# EAGLE design mt15_reg (EAGLE 6.6.0)

## Sheet 1 of 6
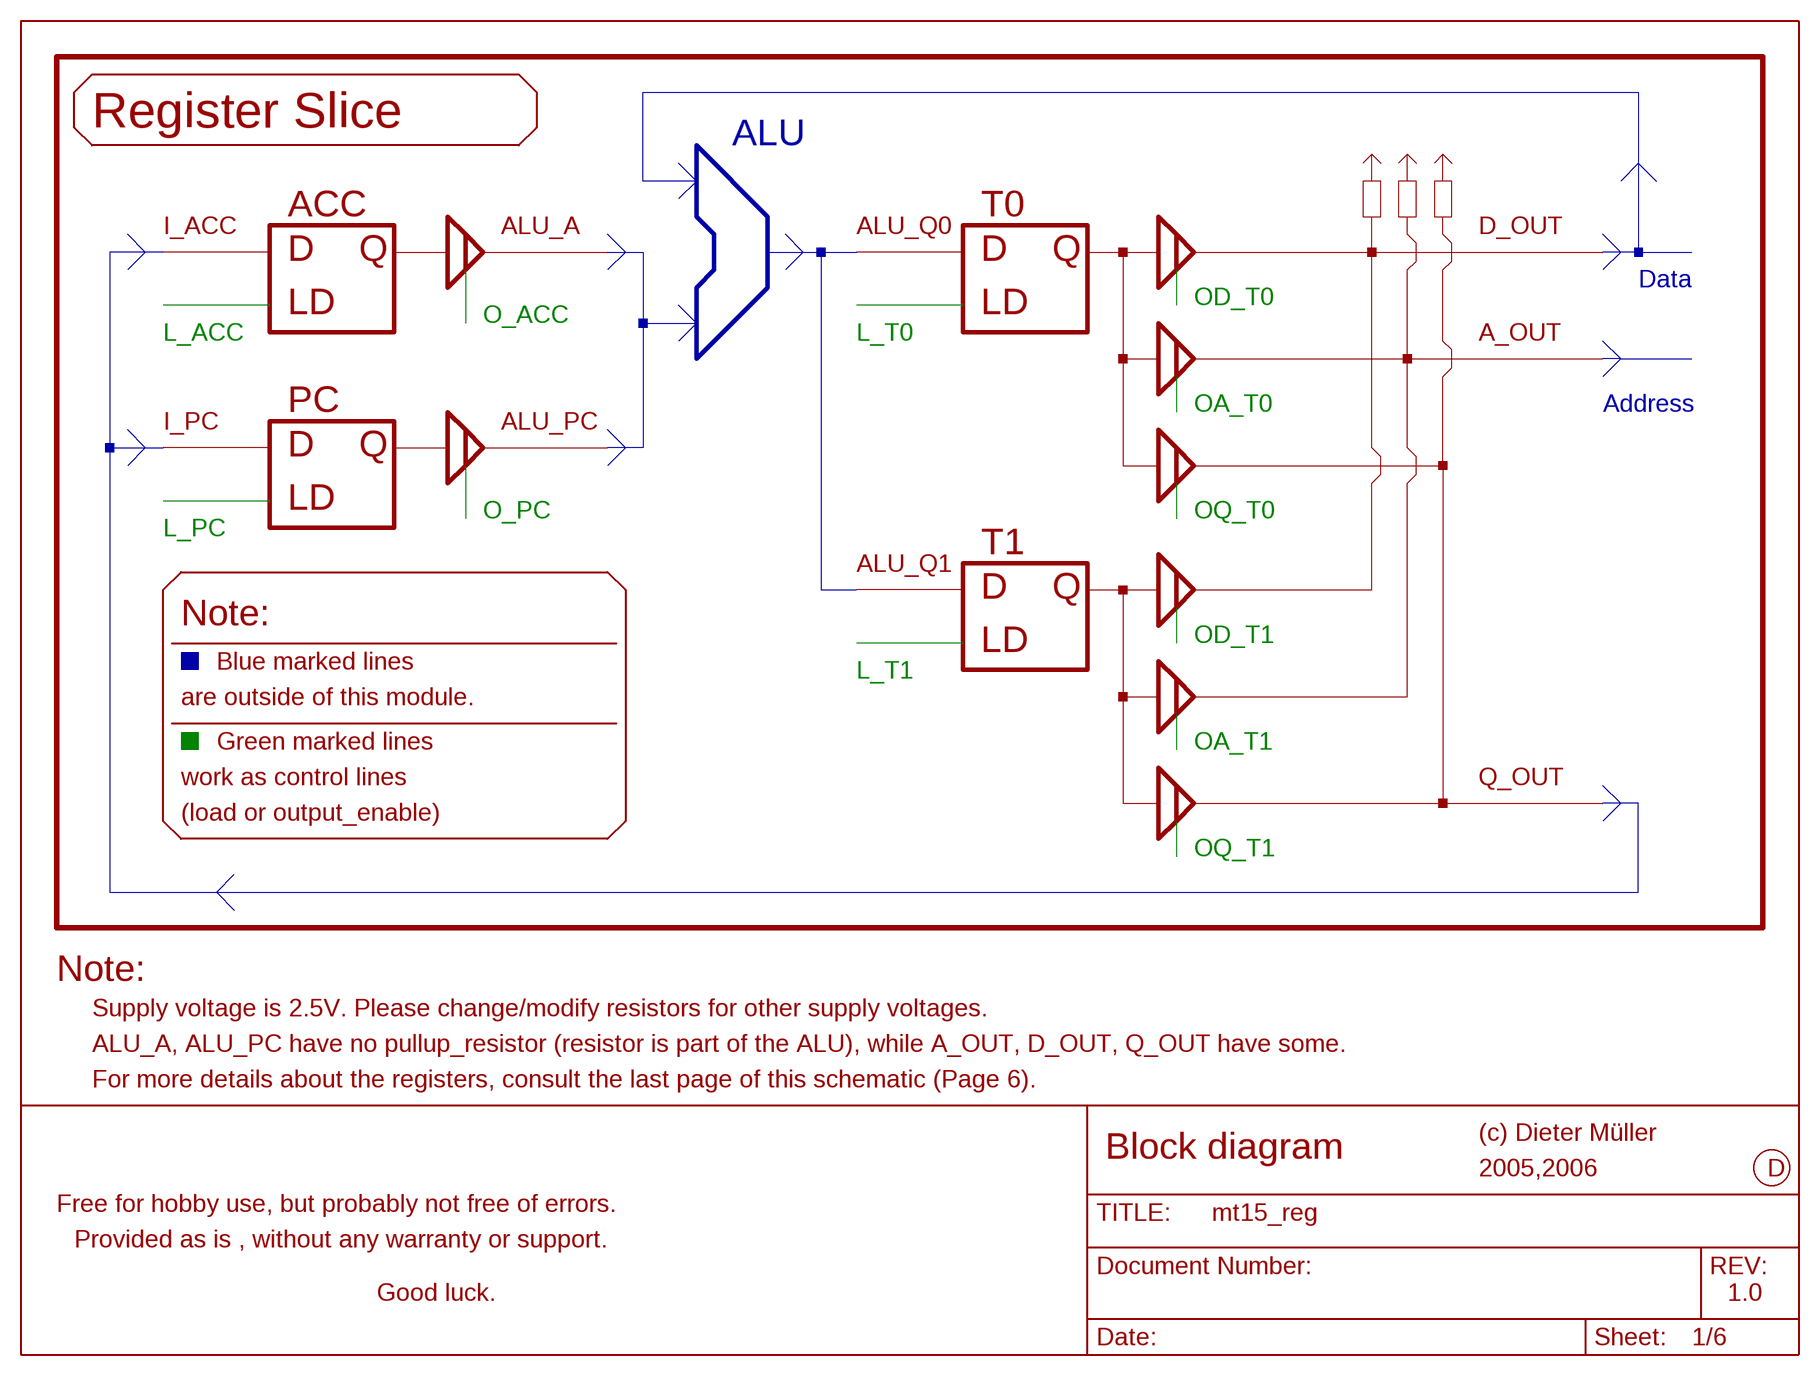
[diagram p0: schematic, sheet 1]

### Buses
B$14
B$15
B$18
B$19

### Notes on the sheet
- Register Slice
- ALU
- ACC | T0
- I_ACC | ALU_A | ALU_Q0 | D_OUT
- D | Q | D | Q
- Data
- OD_T0
- LD | LD
- O_ACC
- L_ACC | L_T0 | A_OUT
- PC | OA_T0 | Address
- I_PC | ALU_PC
- D | Q
- LD
- O_PC | OQ_T0
- L_PC
- T1
- ALU_Q1
- D | Q
- Note:
- OD_T1
- LD
- Blue marked lines
- L_T1
- are outside of this module.
- Green marked lines | OA_T1
- work as control lines | Q_OUT
- (load or output_enable)
- OQ_T1
- Note:
- Supply voltage is 2.5V. Please change/modify resistors for other supply voltages.
- ALU_A, ALU_PC have no pullup_resistor (resistor is part of the ALU), while A_OUT, D_OUT, Q_OUT have some.
- For more details about the registers, consult the last page of this schematic (Page 6).
- (c) Dieter Müller
- Block diagram
- 2005,2006 | D
- Free for hobby use, but probably not free of errors.
- Provided as is , without any warranty or support.
- Good luck. | 1.0
- Das Marketing hat etwas verkauft für Geld, für Geld
- Es wurde noch nicht erfunden auf der Welt, der Welt.
- Und sie geben dir nur ein paar Stunden Zeit,
- und stellen dir wieder kein Geld bereit.
- Aber unbeirrbar, arbeitest du vor dich hin.
- Du zeichnest nun dein Schaltbild am PC, PC.
- Er stürzt dauernd ab, dein Rücken tut dir weh, so weh.
- Ein paar Vorgaben kannst du nicht lesen hier,
- dahingekritzelt auf Brotpapier.
- Aber unbeirrbar, arbeitest du vor dich hin.
- Die Chips haben heut' Gehäuse winzig klein, so klein.
- Wer hat dich gefragt, du lötest sie nur ein, nur ein.
- Und das Zinn verläuft zu 'nem kleinen See,
- so langsam tun' dir die Augen weh.
- Aber unbeirrbar, arbeitest du vor dich hin.
- Für das Projekt noch Software bräuchte man, braucht man.
- Ein paar tausend Zeilen Quellcode muss noch dran, noch dran.
- Ein paar Bugs, die hast du schon festgestellt.
- Der Compiler dir in den Rücken fällt.
- Aber unbeirrbar, arbeitest du vor dich hin.
- Das Gerät ist fertig, doch an Fehlern reich, so reich.
- Du würdest sie gerne finden, und zwar gleich, jetzt gleich.
- Doch das Marketing verkauft es dann,
- und schleppt dir den nächsten Auftrag ran.
- Aber unbeirrbar, arbeitest du vor dich hin.

## Sheet 2 of 6
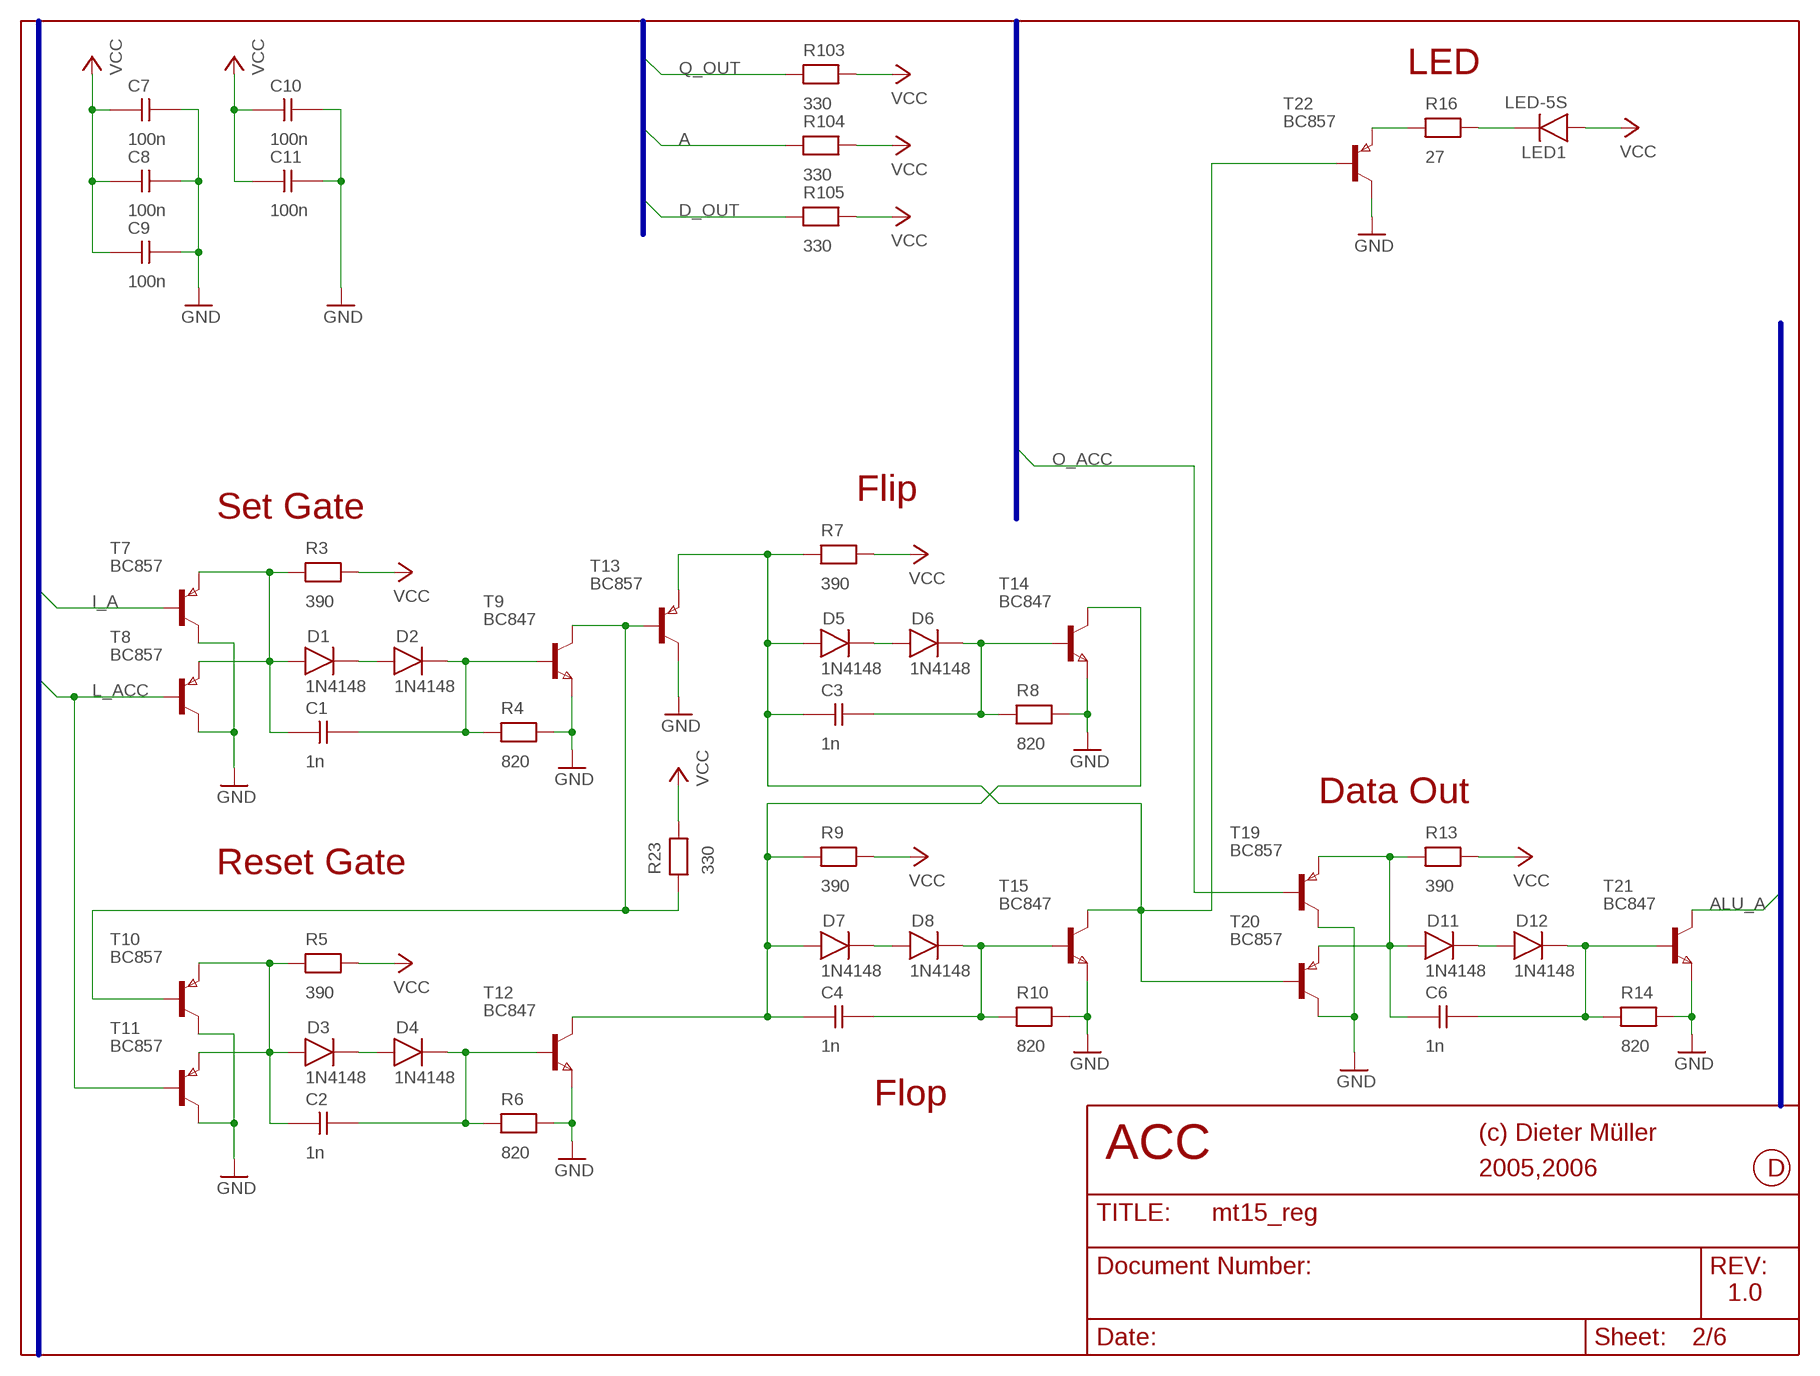
[diagram p1: schematic, sheet 2]

### Parts
C1  1n  CAPNP-5  [0204]
C2  1n  CAPNP-5  [0204]
C3  1n  CAPNP-5  [0204]
C4  1n  CAPNP-5  [0204]
C6  1n  CAPNP-5  [0204]
C7  100n  CAPNP-5  [0204]
C8  100n  CAPNP-5  [0204]
C9  100n  CAPNP-5  [0204]
C10  100n  CAPNP-5  [0204]
C11  100n  CAPNP-5  [0204]
D1  1N4148  DIODE-7,5  [0204D]
D2  1N4148  DIODE-7,5  [0204D]
D3  1N4148  DIODE-7,5  [0204D]
D4  1N4148  DIODE-7,5  [0204D]
D5  1N4148  DIODE-7,5  [0204D]
D6  1N4148  DIODE-7,5  [0204D]
D7  1N4148  DIODE-7,5  [0204D]
D8  1N4148  DIODE-7,5  [0204D]
D11  1N4148  DIODE-7,5  [0204D]
D12  1N4148  DIODE-7,5  [0204D]
LED1  LED-5S  [LED-5S]
R3  390  RESEU-7,5  [0204]
R4  820  RESEU-7,5  [0204]
R5  390  RESEU-7,5  [0204]
R6  820  RESEU-7,5  [0204]
R7  390  RESEU-7,5  [0204]
R8  820  RESEU-7,5  [0204]
R9  390  RESEU-7,5  [0204]
R10  820  RESEU-7,5  [0204]
R13  390  RESEU-7,5  [0204]
R14  820  RESEU-7,5  [0204]
R16  27  RESEU-7,5  [0204]
R23  330  RESEU-7,5  [0204]
R103  330  RESEU-7,5  [0204]
R104  330  RESEU-7,5  [0204]
R105  330  RESEU-7,5  [0204]
T7  BC857  BC557  [SOT-23]
T8  BC857  BC557  [SOT-23]
T9  BC847  BC547  [SOT-23]
T10  BC857  BC557  [SOT-23]
T11  BC857  BC557  [SOT-23]
T12  BC847  BC547  [SOT-23]
T13  BC857  BC557  [SOT-23]
T14  BC847  BC547  [SOT-23]
T15  BC847  BC547  [SOT-23]
T19  BC857  BC557  [SOT-23]
T20  BC857  BC557  [SOT-23]
T21  BC847  BC547  [SOT-23]
T22  BC857  BC557  [SOT-23]

### Nets
A: R104.1 ; also sheet 4,5
ALU_A: T21.3(C)
D_OUT: R105.1 ; also sheet 4,5
GND: C7.2 C8.2 C9.2 C10.2 C11.2 R4.2 R6.2 R8.2 R10.2 R14.2 T7.3(C) T8.3(C) T9.1(E) T10.3(C) T11.3(C) T12.1(E) T13.3(C) T14.1(E) T15.1(E) T19.3(C) T20.3(C) T21.1(E) T22.3(C) ; also sheet 3,4,5
I_A: T7.2(B)
L_ACC: T8.2(B) T11.2(B)
N$11: C1.1 D1.1(A) R3.1 T7.1(E) T8.1(E)
N$12: D1.2(K) D2.1(A)
N$14: C1.2 D2.2(K) R4.1 T9.2(B)
N$15: D5.2(K) D6.1(A)
N$17: C2.1 D3.1(A) R5.1 T10.1(E) T11.1(E)
N$18: D3.2(K) D4.1(A)
N$19: C2.2 D4.2(K) R6.1 T12.2(B)
N$20: C3.2 D6.2(K) R8.1 T14.2(B)
N$21: D7.2(K) D8.1(A)
N$22: C4.2 D8.2(K) R10.1 T15.2(B)
N$23: C4.1 D7.1(A) R9.1 T12.3(C) T14.3(C)
N$24: C3.1 D5.1(A) R7.1 T13.1(E) T15.3(C) T20.2(B) T22.2(B)
N$25: R16.1 T22.1(E)
N$29: LED1.2(K) R16.2
N$30: C6.1 D11.1(A) R13.1 T19.1(E) T20.1(E)
N$31: D11.2(K) D12.1(A)
N$32: C6.2 D12.2(K) R14.1 T21.2(B)
N$45: R23.1 T9.3(C) T10.2(B) T13.2(B)
O_ACC: T19.2(B)
Q_OUT: R103.1 ; also sheet 4,5
VCC: C7.1 C8.1 C9.1 C10.1 C11.1 LED1.1(A) R3.2 R5.2 R7.2 R9.2 R13.2 R23.2 R103.2 R104.2 R105.2 ; also sheet 3,4,5,6

### Buses
B$1
B$2
B$3
B$13

### Notes on the sheet
- LED
- Flip
- Set Gate
- Data Out
- Reset Gate
- Flop
- (c) Dieter Müller
- ACC
- 2005,2006 | D
- 1.0

## Sheet 3 of 6
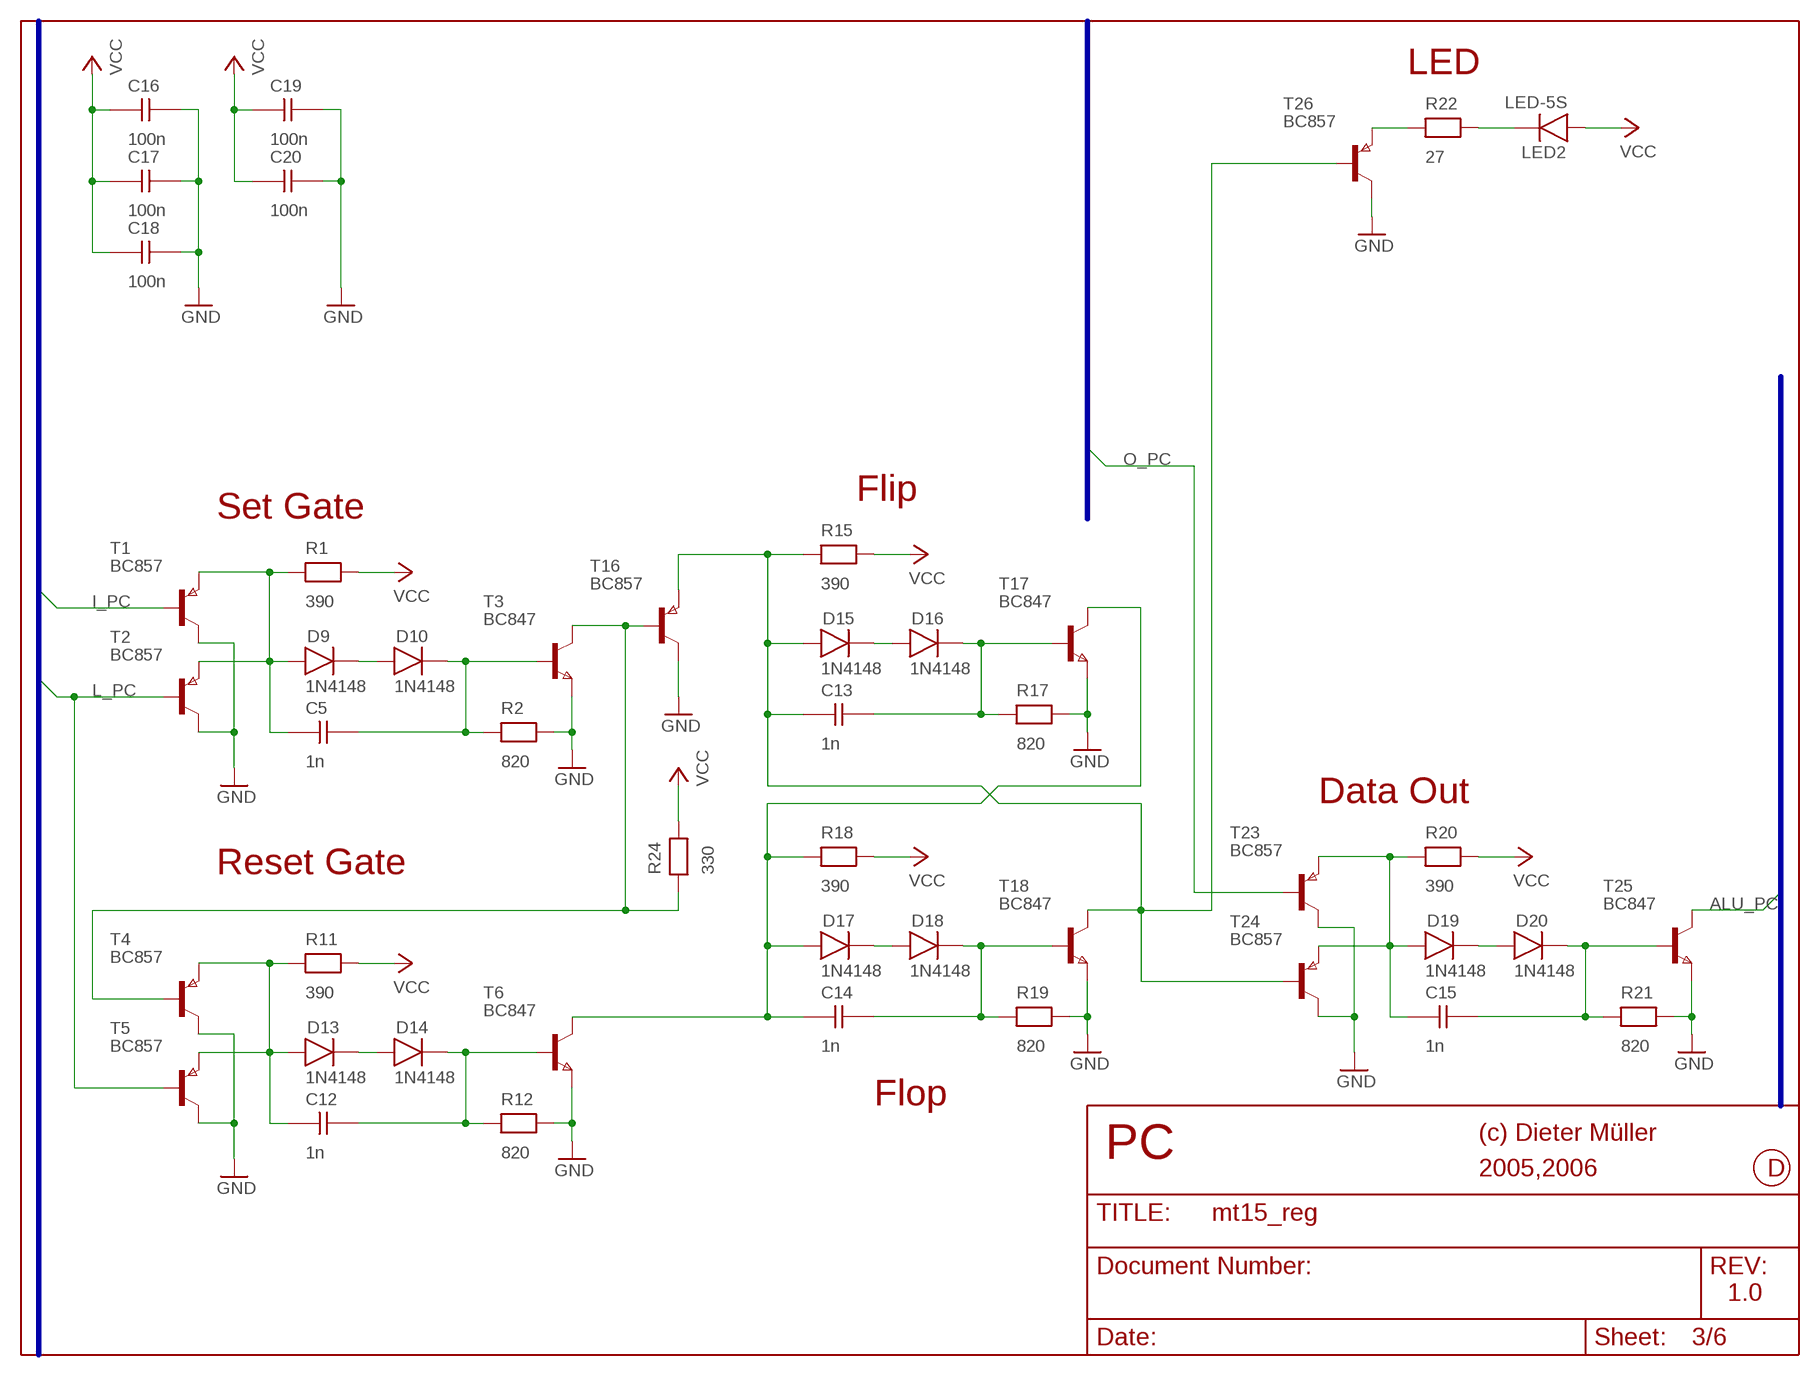
[diagram p2: schematic, sheet 3]

### Parts
C5  1n  CAPNP-5  [0204]
C12  1n  CAPNP-5  [0204]
C13  1n  CAPNP-5  [0204]
C14  1n  CAPNP-5  [0204]
C15  1n  CAPNP-5  [0204]
C16  100n  CAPNP-5  [0204]
C17  100n  CAPNP-5  [0204]
C18  100n  CAPNP-5  [0204]
C19  100n  CAPNP-5  [0204]
C20  100n  CAPNP-5  [0204]
D9  1N4148  DIODE-7,5  [0204D]
D10  1N4148  DIODE-7,5  [0204D]
D13  1N4148  DIODE-7,5  [0204D]
D14  1N4148  DIODE-7,5  [0204D]
D15  1N4148  DIODE-7,5  [0204D]
D16  1N4148  DIODE-7,5  [0204D]
D17  1N4148  DIODE-7,5  [0204D]
D18  1N4148  DIODE-7,5  [0204D]
D19  1N4148  DIODE-7,5  [0204D]
D20  1N4148  DIODE-7,5  [0204D]
LED2  LED-5S  [LED-5S]
R1  390  RESEU-7,5  [0204]
R2  820  RESEU-7,5  [0204]
R11  390  RESEU-7,5  [0204]
R12  820  RESEU-7,5  [0204]
R15  390  RESEU-7,5  [0204]
R17  820  RESEU-7,5  [0204]
R18  390  RESEU-7,5  [0204]
R19  820  RESEU-7,5  [0204]
R20  390  RESEU-7,5  [0204]
R21  820  RESEU-7,5  [0204]
R22  27  RESEU-7,5  [0204]
R24  330  RESEU-7,5  [0204]
T1  BC857  BC557  [SOT-23]
T2  BC857  BC557  [SOT-23]
T3  BC847  BC547  [SOT-23]
T4  BC857  BC557  [SOT-23]
T5  BC857  BC557  [SOT-23]
T6  BC847  BC547  [SOT-23]
T16  BC857  BC557  [SOT-23]
T17  BC847  BC547  [SOT-23]
T18  BC847  BC547  [SOT-23]
T23  BC857  BC557  [SOT-23]
T24  BC857  BC557  [SOT-23]
T25  BC847  BC547  [SOT-23]
T26  BC857  BC557  [SOT-23]

### Nets
ALU_PC: T25.3(C)
GND: C16.2 C17.2 C18.2 C19.2 C20.2 R2.2 R12.2 R17.2 R19.2 R21.2 T1.3(C) T2.3(C) T3.1(E) T4.3(C) T5.3(C) T6.1(E) T16.3(C) T17.1(E) T18.1(E) T23.3(C) T24.3(C) T25.1(E) T26.3(C) ; also sheet 2,4,5
I_PC: T1.2(B)
L_PC: T2.2(B) T5.2(B)
N$9: C5.1 D9.1(A) R1.1 T1.1(E) T2.1(E)
N$10: D9.2(K) D10.1(A)
N$13: C5.2 D10.2(K) R2.1 T3.2(B)
N$26: R24.1 T3.3(C) T4.2(B) T16.2(B)
N$27: C12.1 D13.1(A) R11.1 T4.1(E) T5.1(E)
N$28: D13.2(K) D14.1(A)
N$33: C12.2 D14.2(K) R12.1 T6.2(B)
N$34: D15.2(K) D16.1(A)
N$35: C13.2 D16.2(K) R17.1 T17.2(B)
N$36: D17.2(K) D18.1(A)
N$37: C14.2 D18.2(K) R19.1 T18.2(B)
N$38: C14.1 D17.1(A) R18.1 T6.3(C) T17.3(C)
N$39: C13.1 D15.1(A) R15.1 T16.1(E) T18.3(C) T24.2(B) T26.2(B)
N$40: C15.1 D19.1(A) R20.1 T23.1(E) T24.1(E)
N$41: D19.2(K) D20.1(A)
N$42: C15.2 D20.2(K) R21.1 T25.2(B)
N$43: R22.1 T26.1(E)
N$44: LED2.2(K) R22.2
O_PC: T23.2(B)
VCC: C16.1 C17.1 C18.1 C19.1 C20.1 LED2.1(A) R1.2 R11.2 R15.2 R18.2 R20.2 R24.2 ; also sheet 2,4,5,6

### Buses
B$1
B$2
B$3

### Notes on the sheet
- LED
- Flip
- Set Gate
- Data Out
- Reset Gate
- Flop
- (c) Dieter Müller
- PC
- 2005,2006 | D
- 1.0

## Sheet 4 of 6
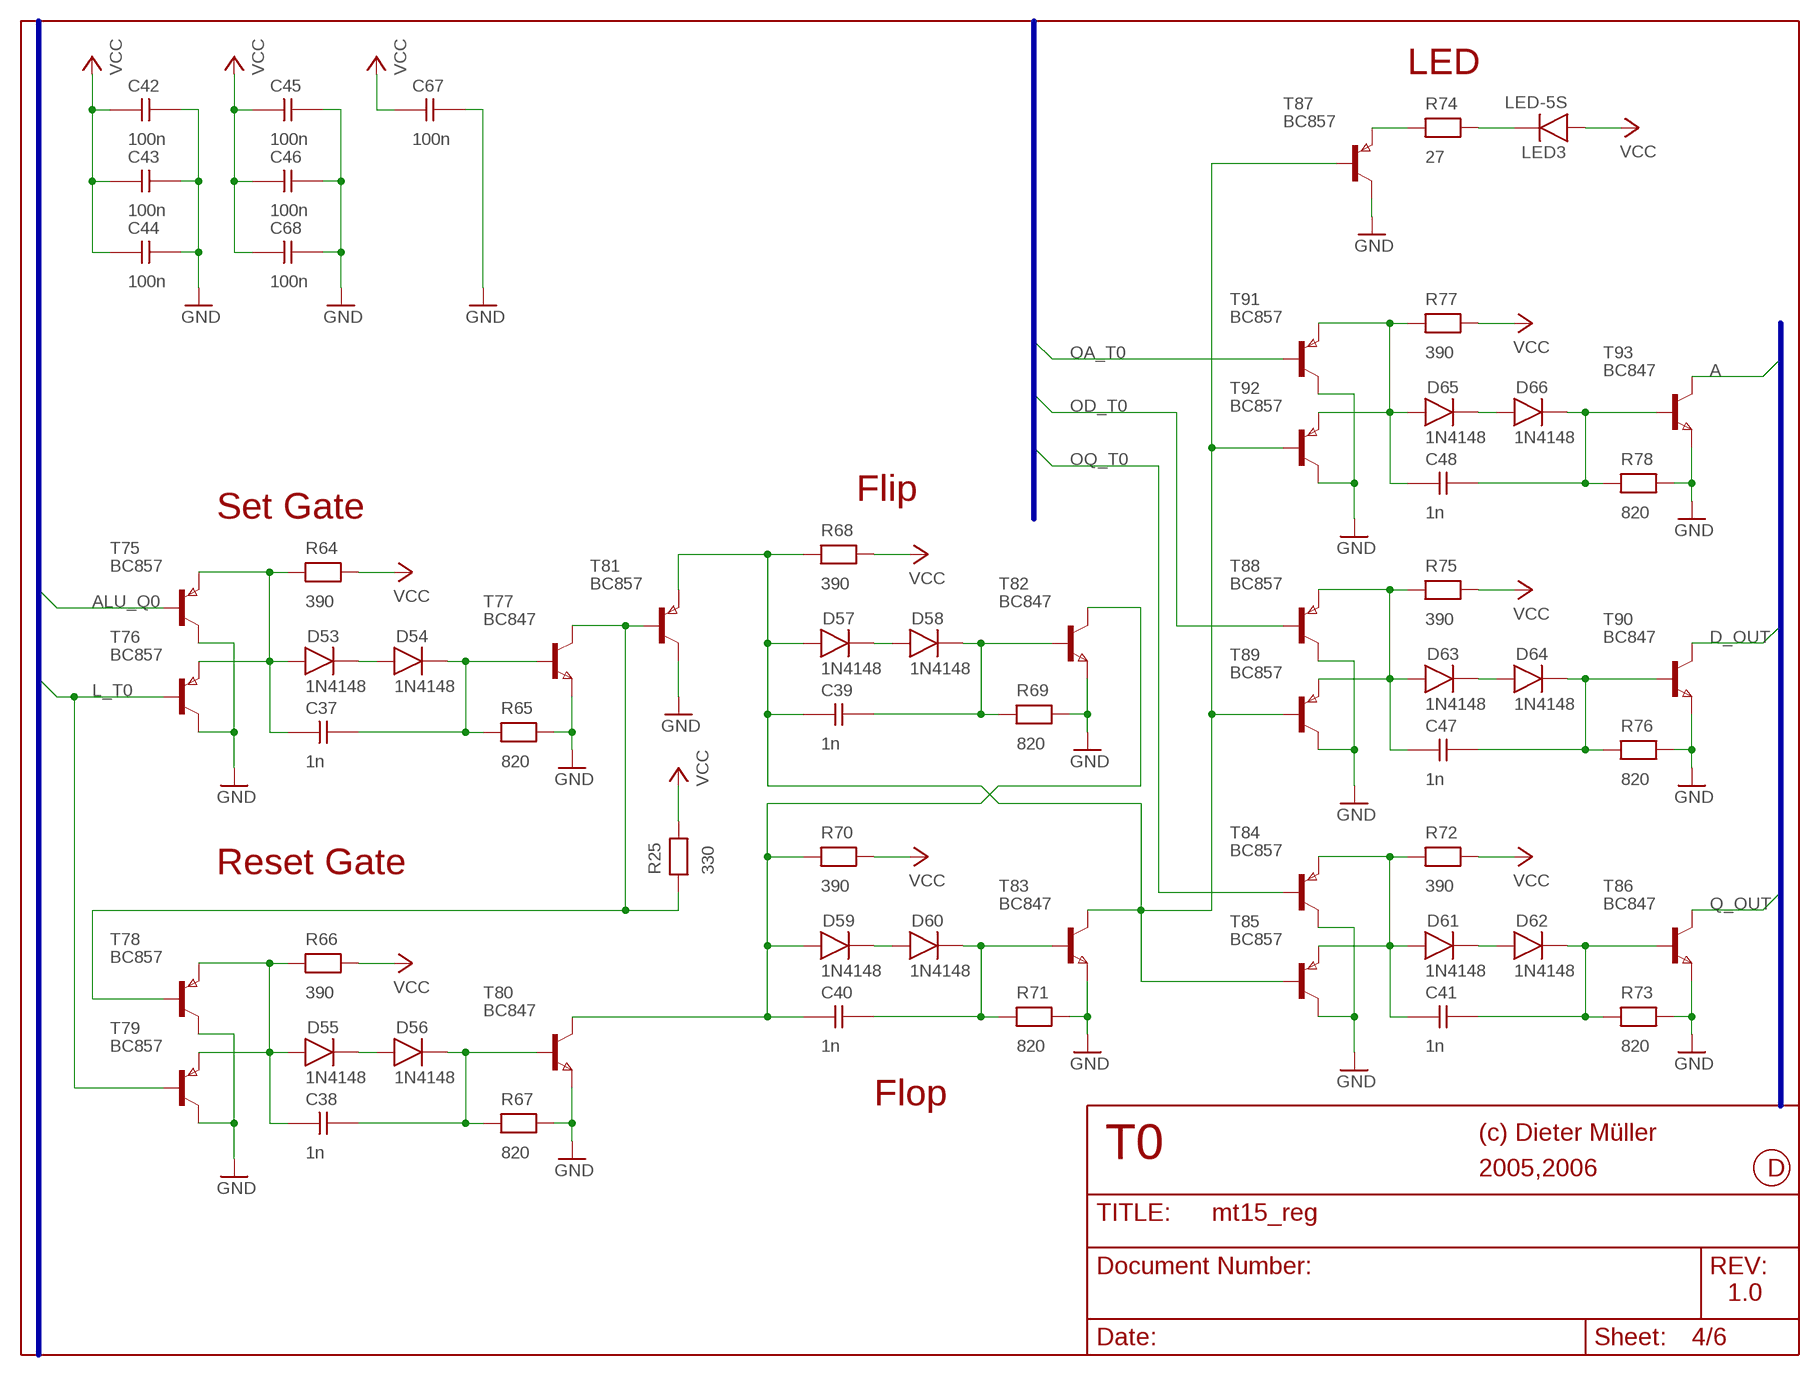
[diagram p3: schematic, sheet 4]

### Parts
C37  1n  CAPNP-5  [0204]
C38  1n  CAPNP-5  [0204]
C39  1n  CAPNP-5  [0204]
C40  1n  CAPNP-5  [0204]
C41  1n  CAPNP-5  [0204]
C42  100n  CAPNP-5  [0204]
C43  100n  CAPNP-5  [0204]
C44  100n  CAPNP-5  [0204]
C45  100n  CAPNP-5  [0204]
C46  100n  CAPNP-5  [0204]
C47  1n  CAPNP-5  [0204]
C48  1n  CAPNP-5  [0204]
C67  100n  CAPNP-5  [0204]
C68  100n  CAPNP-5  [0204]
D53  1N4148  DIODE-7,5  [0204D]
D54  1N4148  DIODE-7,5  [0204D]
D55  1N4148  DIODE-7,5  [0204D]
D56  1N4148  DIODE-7,5  [0204D]
D57  1N4148  DIODE-7,5  [0204D]
D58  1N4148  DIODE-7,5  [0204D]
D59  1N4148  DIODE-7,5  [0204D]
D60  1N4148  DIODE-7,5  [0204D]
D61  1N4148  DIODE-7,5  [0204D]
D62  1N4148  DIODE-7,5  [0204D]
D63  1N4148  DIODE-7,5  [0204D]
D64  1N4148  DIODE-7,5  [0204D]
D65  1N4148  DIODE-7,5  [0204D]
D66  1N4148  DIODE-7,5  [0204D]
LED3  LED-5S  [LED-5S]
R25  330  RESEU-7,5  [0204]
R64  390  RESEU-7,5  [0204]
R65  820  RESEU-7,5  [0204]
R66  390  RESEU-7,5  [0204]
R67  820  RESEU-7,5  [0204]
R68  390  RESEU-7,5  [0204]
R69  820  RESEU-7,5  [0204]
R70  390  RESEU-7,5  [0204]
R71  820  RESEU-7,5  [0204]
R72  390  RESEU-7,5  [0204]
R73  820  RESEU-7,5  [0204]
R74  27  RESEU-7,5  [0204]
R75  390  RESEU-7,5  [0204]
R76  820  RESEU-7,5  [0204]
R77  390  RESEU-7,5  [0204]
R78  820  RESEU-7,5  [0204]
T75  BC857  BC557  [SOT-23]
T76  BC857  BC557  [SOT-23]
T77  BC847  BC547  [SOT-23]
T78  BC857  BC557  [SOT-23]
T79  BC857  BC557  [SOT-23]
T80  BC847  BC547  [SOT-23]
T81  BC857  BC557  [SOT-23]
T82  BC847  BC547  [SOT-23]
T83  BC847  BC547  [SOT-23]
T84  BC857  BC557  [SOT-23]
T85  BC857  BC557  [SOT-23]
T86  BC847  BC547  [SOT-23]
T87  BC857  BC557  [SOT-23]
T88  BC857  BC557  [SOT-23]
T89  BC857  BC557  [SOT-23]
T90  BC847  BC547  [SOT-23]
T91  BC857  BC557  [SOT-23]
T92  BC857  BC557  [SOT-23]
T93  BC847  BC547  [SOT-23]

### Nets
A: T93.3(C) ; also sheet 2,5
ALU_Q0: T75.2(B)
D_OUT: T90.3(C) ; also sheet 2,5
GND: C42.2 C43.2 C44.2 C45.2 C46.2 C67.2 C68.2 R65.2 R67.2 R69.2 R71.2 R73.2 R76.2 R78.2 T75.3(C) T76.3(C) T77.1(E) T78.3(C) T79.3(C) T80.1(E) T81.3(C) T82.1(E) T83.1(E) T84.3(C) T85.3(C) T86.1(E) T87.3(C) T88.3(C) T89.3(C) T90.1(E) T91.3(C) T92.3(C) T93.1(E) ; also sheet 2,3,5
L_T0: T76.2(B) T79.2(B)
N$93: C37.1 D53.1(A) R64.1 T75.1(E) T76.1(E)
N$94: D53.2(K) D54.1(A)
N$95: C37.2 D54.2(K) R65.1 T77.2(B)
N$96: R25.1 T77.3(C) T78.2(B) T81.2(B)
N$97: C38.1 D55.1(A) R66.1 T78.1(E) T79.1(E)
N$98: D55.2(K) D56.1(A)
N$99: C38.2 D56.2(K) R67.1 T80.2(B)
N$100: D57.2(K) D58.1(A)
N$101: C39.2 D58.2(K) R69.1 T82.2(B)
N$102: D59.2(K) D60.1(A)
N$103: C40.2 D60.2(K) R71.1 T83.2(B)
N$104: C40.1 D59.1(A) R70.1 T80.3(C) T82.3(C)
N$105: C39.1 D57.1(A) R68.1 T81.1(E) T83.3(C) T85.2(B) T87.2(B) T89.2(B) T92.2(B)
N$106: C41.1 D61.1(A) R72.1 T84.1(E) T85.1(E)
N$107: D61.2(K) D62.1(A)
N$108: C41.2 D62.2(K) R73.1 T86.2(B)
N$109: R74.1 T87.1(E)
N$110: LED3.2(K) R74.2
N$112: C47.1 D63.1(A) R75.1 T88.1(E) T89.1(E)
N$113: D63.2(K) D64.1(A)
N$114: C47.2 D64.2(K) R76.1 T90.2(B)
N$116: C48.1 D65.1(A) R77.1 T91.1(E) T92.1(E)
N$117: D65.2(K) D66.1(A)
N$118: C48.2 D66.2(K) R78.1 T93.2(B)
OA_T0: T91.2(B)
OD_T0: T88.2(B)
OQ_T0: T84.2(B)
Q_OUT: T86.3(C) ; also sheet 2,5
VCC: C42.1 C43.1 C44.1 C45.1 C46.1 C67.1 C68.1 LED3.1(A) R25.2 R64.2 R66.2 R68.2 R70.2 R72.2 R75.2 R77.2 ; also sheet 2,3,5,6

### Buses
B$1
B$2
B$3

### Notes on the sheet
- LED
- Flip
- Set Gate
- Reset Gate
- Flop
- (c) Dieter Müller
- T0
- 2005,2006 | D
- 1.0

## Sheet 5 of 6
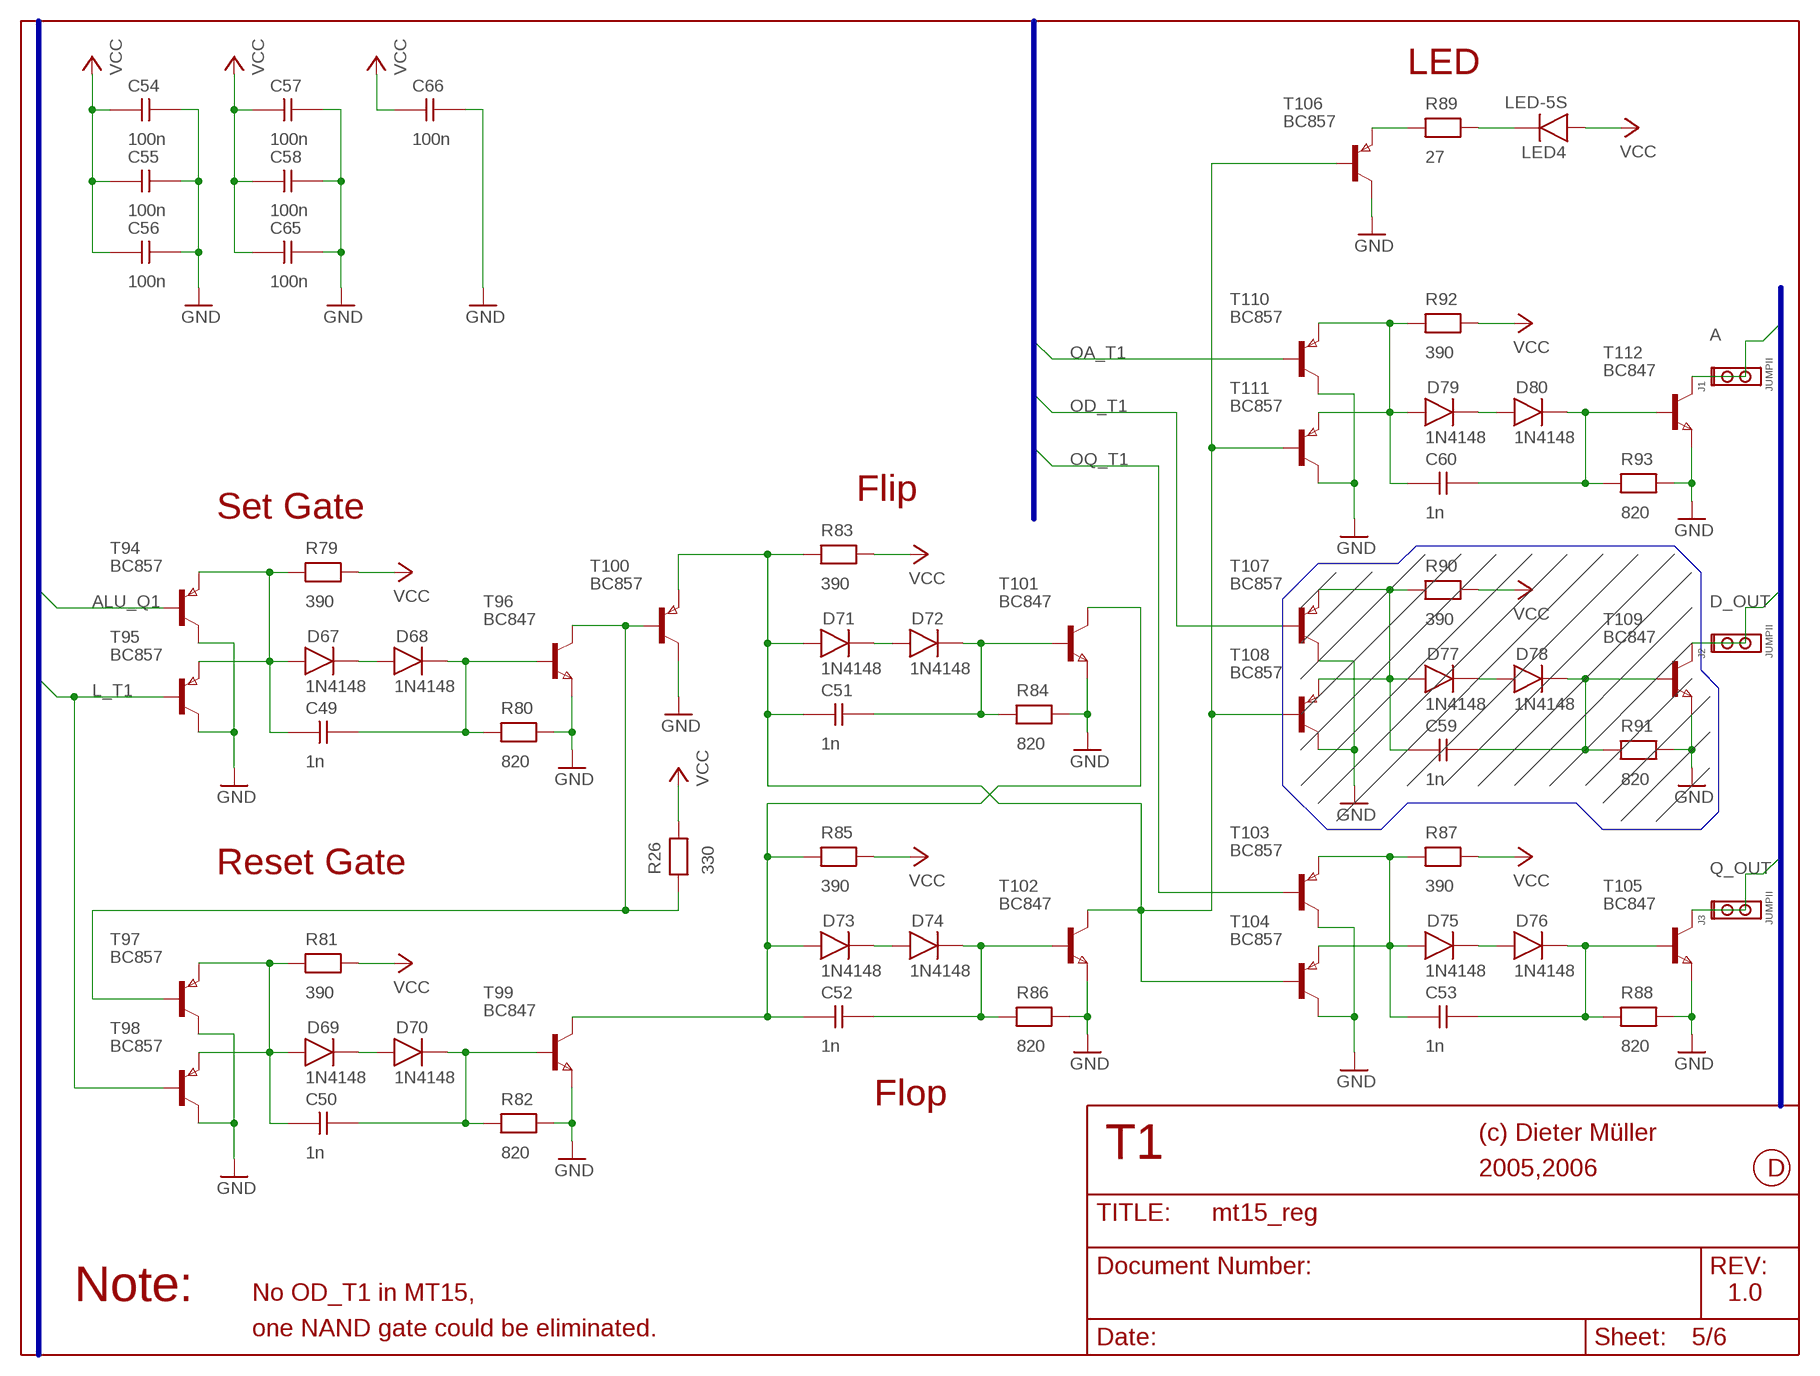
[diagram p4: schematic, sheet 5]

### Parts
C49  1n  CAPNP-5  [0204]
C50  1n  CAPNP-5  [0204]
C51  1n  CAPNP-5  [0204]
C52  1n  CAPNP-5  [0204]
C53  1n  CAPNP-5  [0204]
C54  100n  CAPNP-5  [0204]
C55  100n  CAPNP-5  [0204]
C56  100n  CAPNP-5  [0204]
C57  100n  CAPNP-5  [0204]
C58  100n  CAPNP-5  [0204]
C59  1n  CAPNP-5  [0204]
C60  1n  CAPNP-5  [0204]
C65  100n  CAPNP-5  [0204]
C66  100n  CAPNP-5  [0204]
D67  1N4148  DIODE-7,5  [0204D]
D68  1N4148  DIODE-7,5  [0204D]
D69  1N4148  DIODE-7,5  [0204D]
D70  1N4148  DIODE-7,5  [0204D]
D71  1N4148  DIODE-7,5  [0204D]
D72  1N4148  DIODE-7,5  [0204D]
D73  1N4148  DIODE-7,5  [0204D]
D74  1N4148  DIODE-7,5  [0204D]
D75  1N4148  DIODE-7,5  [0204D]
D76  1N4148  DIODE-7,5  [0204D]
D77  1N4148  DIODE-7,5  [0204D]
D78  1N4148  DIODE-7,5  [0204D]
D79  1N4148  DIODE-7,5  [0204D]
D80  1N4148  DIODE-7,5  [0204D]
J1  JUMPII  JUMPII@2  [JUMPII]
J2  JUMPII  JUMPII@2  [JUMPII]
J3  JUMPII  JUMPII@2  [JUMPII]
LED4  LED-5S  [LED-5S]
R26  330  RESEU-7,5  [0204]
R79  390  RESEU-7,5  [0204]
R80  820  RESEU-7,5  [0204]
R81  390  RESEU-7,5  [0204]
R82  820  RESEU-7,5  [0204]
R83  390  RESEU-7,5  [0204]
R84  820  RESEU-7,5  [0204]
R85  390  RESEU-7,5  [0204]
R86  820  RESEU-7,5  [0204]
R87  390  RESEU-7,5  [0204]
R88  820  RESEU-7,5  [0204]
R89  27  RESEU-7,5  [0204]
R90  390  RESEU-7,5  [0204]
R91  820  RESEU-7,5  [0204]
R92  390  RESEU-7,5  [0204]
R93  820  RESEU-7,5  [0204]
T94  BC857  BC557  [SOT-23]
T95  BC857  BC557  [SOT-23]
T96  BC847  BC547  [SOT-23]
T97  BC857  BC557  [SOT-23]
T98  BC857  BC557  [SOT-23]
T99  BC847  BC547  [SOT-23]
T100  BC857  BC557  [SOT-23]
T101  BC847  BC547  [SOT-23]
T102  BC847  BC547  [SOT-23]
T103  BC857  BC557  [SOT-23]
T104  BC857  BC557  [SOT-23]
T105  BC847  BC547  [SOT-23]
T106  BC857  BC557  [SOT-23]
T107  BC857  BC557  [SOT-23]
T108  BC857  BC557  [SOT-23]
T109  BC847  BC547  [SOT-23]
T110  BC857  BC557  [SOT-23]
T111  BC857  BC557  [SOT-23]
T112  BC847  BC547  [SOT-23]

### Nets
A: J1.1 J1.2 T112.3(C) ; also sheet 2,4
ALU_Q1: T94.2(B)
D_OUT: J2.1 J2.2 T109.3(C) ; also sheet 2,4
GND: C54.2 C55.2 C56.2 C57.2 C58.2 C65.2 C66.2 R80.2 R82.2 R84.2 R86.2 R88.2 R91.2 R93.2 T94.3(C) T95.3(C) T96.1(E) T97.3(C) T98.3(C) T99.1(E) T100.3(C) T101.1(E) T102.1(E) T103.3(C) T104.3(C) T105.1(E) T106.3(C) T107.3(C) T108.3(C) T109.1(E) T110.3(C) T111.3(C) T112.1(E) ; also sheet 2,3,4
L_T1: T95.2(B) T98.2(B)
N$111: C49.1 D67.1(A) R79.1 T94.1(E) T95.1(E)
N$115: D67.2(K) D68.1(A)
N$119: C49.2 D68.2(K) R80.1 T96.2(B)
N$120: R26.1 T96.3(C) T97.2(B) T100.2(B)
N$121: C50.1 D69.1(A) R81.1 T97.1(E) T98.1(E)
N$122: D69.2(K) D70.1(A)
N$123: C50.2 D70.2(K) R82.1 T99.2(B)
N$124: D71.2(K) D72.1(A)
N$125: C51.2 D72.2(K) R84.1 T101.2(B)
N$126: D73.2(K) D74.1(A)
N$127: C52.2 D74.2(K) R86.1 T102.2(B)
N$128: C52.1 D73.1(A) R85.1 T99.3(C) T101.3(C)
N$129: C51.1 D71.1(A) R83.1 T100.1(E) T102.3(C) T104.2(B) T106.2(B) T108.2(B) T111.2(B)
N$130: C53.1 D75.1(A) R87.1 T103.1(E) T104.1(E)
N$131: D75.2(K) D76.1(A)
N$132: C53.2 D76.2(K) R88.1 T105.2(B)
N$133: R89.1 T106.1(E)
N$134: LED4.2(K) R89.2
N$135: C59.1 D77.1(A) R90.1 T107.1(E) T108.1(E)
N$136: D77.2(K) D78.1(A)
N$137: C59.2 D78.2(K) R91.1 T109.2(B)
N$138: C60.1 D79.1(A) R92.1 T110.1(E) T111.1(E)
N$139: D79.2(K) D80.1(A)
N$140: C60.2 D80.2(K) R93.1 T112.2(B)
OA_T1: T110.2(B)
OD_T1: T107.2(B)
OQ_T1: T103.2(B)
Q_OUT: J3.1 J3.2 T105.3(C) ; also sheet 2,4
VCC: C54.1 C55.1 C56.1 C57.1 C58.1 C65.1 C66.1 LED4.1(A) R26.2 R79.2 R81.2 R83.2 R85.2 R87.2 R90.2 R92.2 ; also sheet 2,3,4,6

### Buses
B$1
B$2
B$3
B$18

### Notes on the sheet
- LED
- Flip
- Set Gate
- Reset Gate
- Flop
- (c) Dieter Müller
- T1
- 2005,2006 | D
- Note: | No OD_T1 in MT15, | 1.0
- one NAND gate could be eliminated.

## Sheet 6 of 6
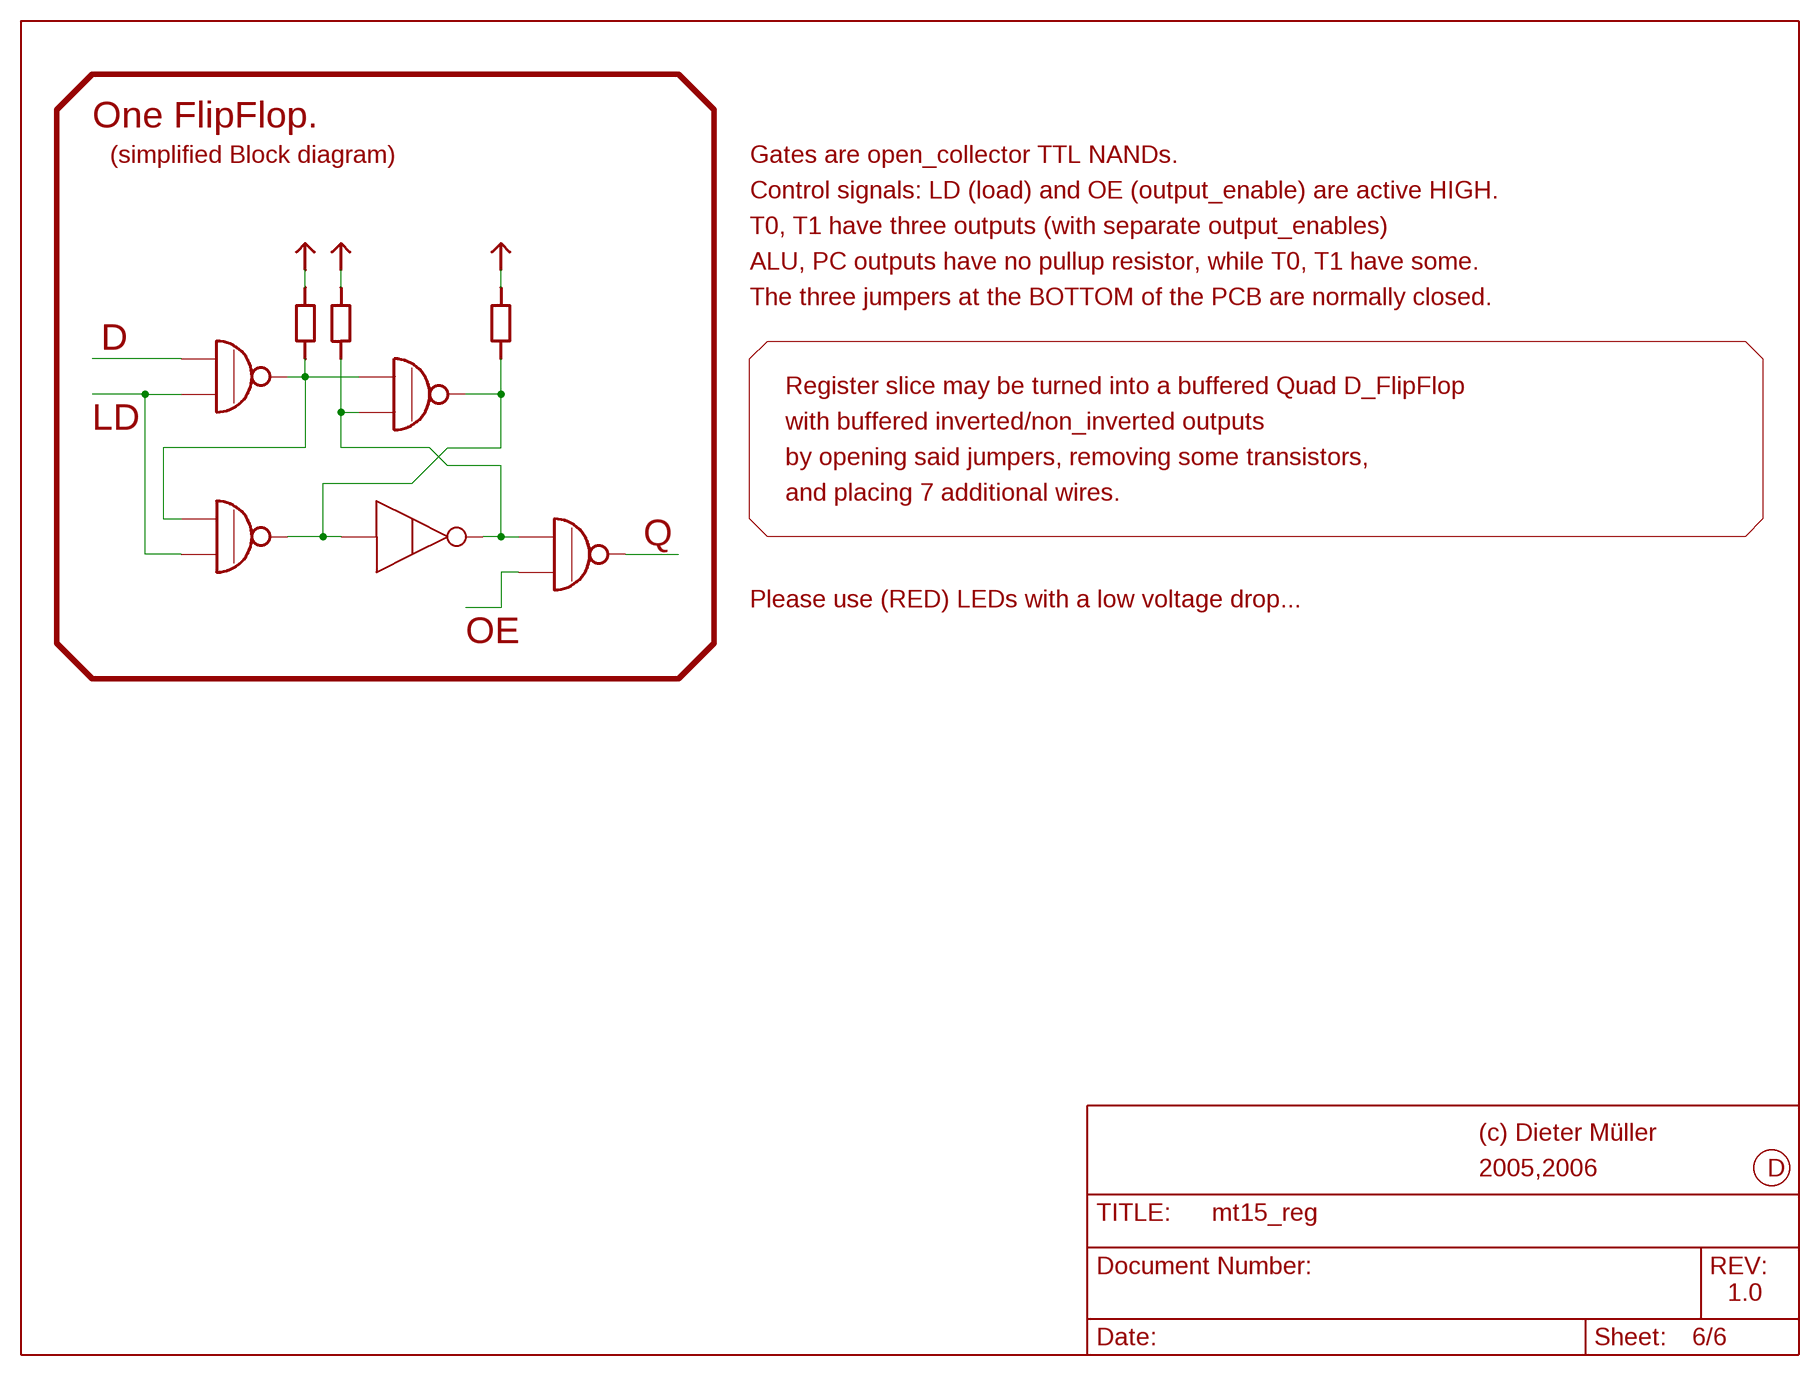
[diagram p5: schematic, sheet 6]

### Notes on the sheet
- One FlipFlop.
- (simplified Block diagram) | Gates are open_collector TTL NANDs.
- Control signals: LD (load) and OE (output_enable) are active HIGH.
- T0, T1 have three outputs (with separate output_enables)
- ALU, PC outputs have no pullup resistor, while T0, T1 have some.
- The three jumpers at the BOTTOM of the PCB are normally closed.
- D
- Register slice may be turned into a buffered Quad D_FlipFlop
- LD | with buffered inverted/non_inverted outputs
- by opening said jumpers, removing some transistors,
- and placing 7 additional wires.
- Q
- Please use (RED) LEDs with a low voltage drop...
- OE
- (c) Dieter Müller
- 2005,2006 | D
- 1.0

## Library data of the parts
C1-C20 C37-C60 C65-C68 = DISCRETE:CAPNP-5
D1-D20 D53-D80 = DISCRETE:DIODE-7,5
J1-J3 = jg:JUMPII@2
LED1-LED4 = M68XXX:LED-5S
R1-R26 R64-R93 R103-R105 = DISCRETE:RESEU-7,5
T1 T2 T4 T5 T7 T8 T10 T11 T13 T16 T19 T20 T22-T24 T26 T75 T76 T78 T79 T81 T84 T85 T87-T89 T91 T92 T94 T95 T97 T98 T100 T103 T104 T106-T108 T110 T111 = PNP:BC557
T3 T6 T9 T12 T14 T15 T17 T18 T21 T25 T77 T80 T82 T83 T86 T90 T93 T96 T99 T101 T102 T105 T109 T112 = NPN:BC547

## Board
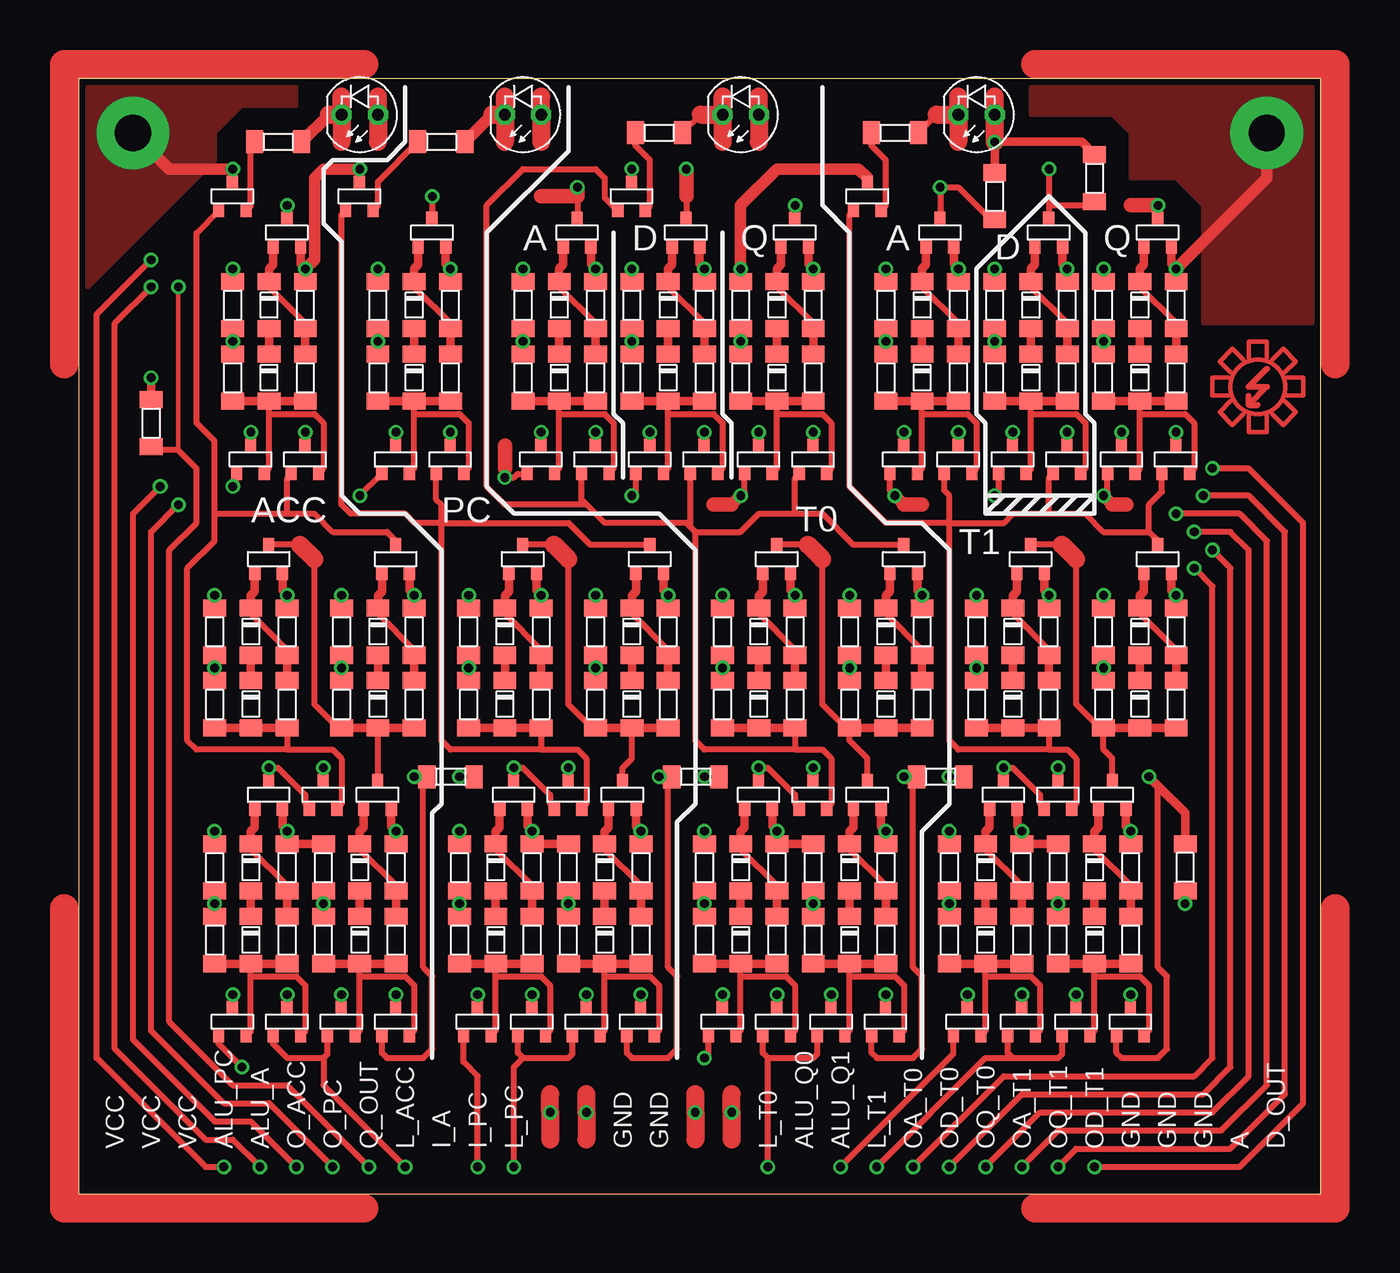
[diagram p6: board, top side]
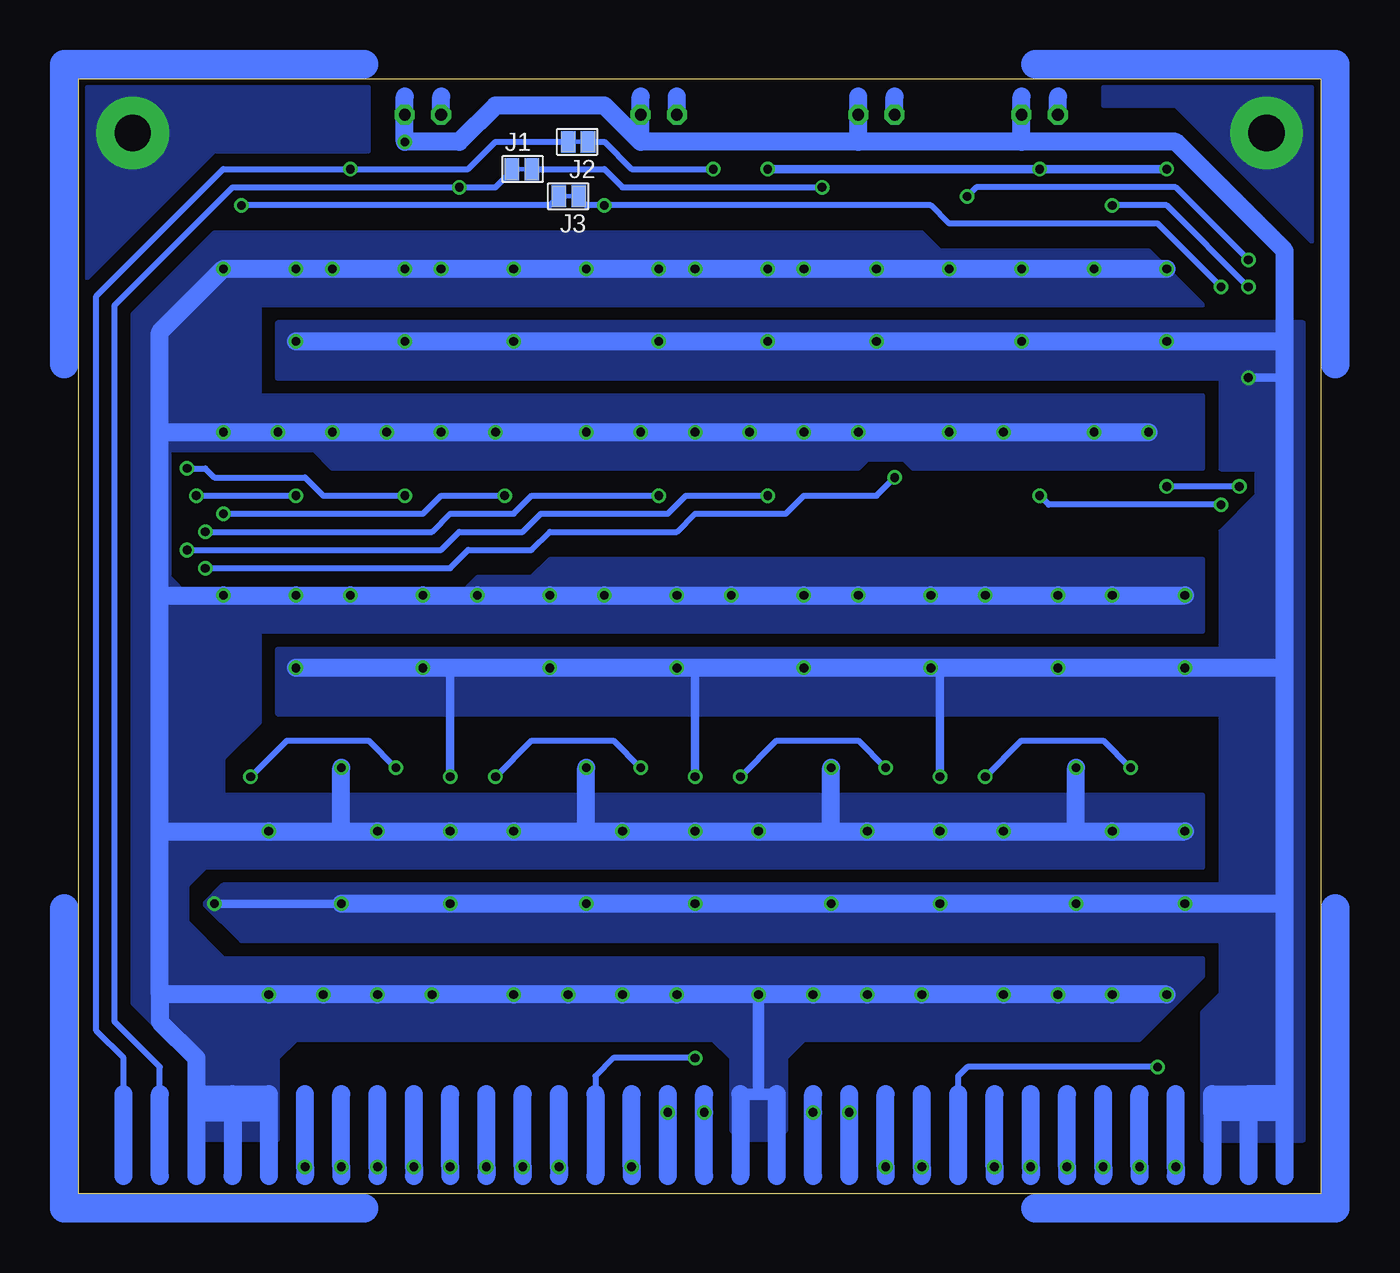
[diagram p7: board, bottom side, seen from below]

Size 86.97 x 78.09 mm. Coordinates in mm from the lower left corner, seen from the top.
Outline: 0,0 86.97,0 86.97,78.09 0,78.09 0,0
Copper layers (1*16): Top 0.035mm / dielectric 1.5mm / Bottom 0.035mm
Design rules "default": minimum track width 10mil, minimum drill 0.6mm, track to track 8mil, track to pad 8mil, pad to pad 8mil, via to via 8mil, smd to smd 8mil, copper to edge 0mil, drill to drill 8mil, minimum pad ring 10mil, minimum via ring 8mil, stop-mask expansion 4mil, vias tented up to drill 0mil, thermal gap 10mil

### Footprints (pad centres in the part's own frame; a part is rotated, then mirrored left to right if it is on the bottom)
0204 = smd 1.194 x 1.6: 1 -1.651,0; 2 1.651,0
0204D = smd 1.194 x 1.6: 1 1.651,0; 2 -1.651,0
JUMPII = smd 1.016 x 1.524: 1 -0.762,0; 2 0.635,0
LED-5S = drill 0.813 pad 1.397 octagon: 1 -1.27,0; 2 1.27,0
SOT-23 = smd 0.787 x 0.889: 1 -0.94,1.016; 2 0.991,1.016; 3 0.025,-1.016

### Placement (x,y rotation side)
C1  14.61,17.78 90 top
C2  22.23,17.78 90 top
C3  14.61,34.29 90 top
C4  23.5,34.29 90 top
C5  31.75,17.78 90 top
C6  15.88,57.15 90 top
C7  9.53,22.86 90 top
C8  17.14,22.86 90 top
C9  9.53,39.37 90 top
C10  18.41,39.37 90 top
C11  10.79,62.23 90 top
C12  39.37,17.78 90 top
C13  32.38,34.29 90 top
C14  41.27,34.29 90 top
C15  26.04,57.15 90 top
C16  26.67,22.86 90 top
C17  34.29,22.86 90 top
C18  27.3,39.37 90 top
C19  36.2,39.37 90 top
C20  20.95,62.23 90 top
C37  48.9,17.78 90 top
C38  56.52,17.78 90 top
C39  50.16,34.29 90 top
C40  59.05,34.29 90 top
C41  51.44,57.15 90 top
C42  43.81,22.86 90 top
C43  51.44,22.86 90 top
C44  45.09,39.37 90 top
C45  53.98,39.37 90 top
C46  31.11,62.23 90 top
C47  43.81,57.15 90 top
C48  36.2,57.15 90 top
C49  66.04,17.78 90 top
C50  73.66,17.78 90 top
C51  67.94,34.29 90 top
C52  76.83,34.29 90 top
C53  76.83,57.15 90 top
C54  60.96,22.86 90 top
C55  68.58,22.86 90 top
C56  62.87,39.37 90 top
C57  71.75,39.37 90 top
C58  56.52,62.23 90 top
C59  69.22,57.15 90 top
C60  61.59,57.15 90 top
C65  64.14,62.23 90 top
C66  71.75,62.23 90 top
C67  38.73,62.23 90 top
C68  46.35,62.23 90 top
D1  12.06,17.78 270 top
D2  12.06,22.86 270 top
D3  19.68,17.78 270 top
D4  19.68,22.86 270 top
D5  12.06,34.29 270 top
D6  12.06,39.37 270 top
D7  20.95,34.29 270 top
D8  20.95,39.37 270 top
D9  29.21,17.78 270 top
D10  29.21,22.86 270 top
D11  13.34,57.15 270 top
D12  13.34,62.23 270 top
D13  36.83,17.78 270 top
D14  36.83,22.86 270 top
D15  29.84,34.29 270 top
D16  29.84,39.37 270 top
D17  38.73,34.29 270 top
D18  38.73,39.37 270 top
D19  23.5,57.15 270 top
D20  23.5,62.23 270 top
D53  46.35,17.78 270 top
D54  46.35,22.86 270 top
D55  53.98,17.78 270 top
D56  53.98,22.86 270 top
D57  47.62,34.29 270 top
D58  47.62,39.37 270 top
D59  56.52,34.29 270 top
D60  56.52,39.37 270 top
D61  48.9,57.15 270 top
D62  48.9,62.23 270 top
D63  41.27,57.15 270 top
D64  41.27,62.23 270 top
D65  33.66,57.15 270 top
D66  33.66,62.23 270 top
D67  63.5,17.78 270 top
D68  63.5,22.86 270 top
D69  71.12,17.78 270 top
D70  71.12,22.86 270 top
D71  65.41,34.29 270 top
D72  65.41,39.37 270 top
D73  74.3,34.29 270 top
D74  74.3,39.37 270 top
D75  74.3,57.15 270 top
D76  74.3,62.23 270 top
D77  66.67,57.15 270 top
D78  66.67,62.23 270 top
D79  59.05,57.15 270 top
D80  59.05,62.23 270 top
J1  55.88,71.75 0 bottom
J2  52.07,73.66 180 bottom
J3  52.7,69.85 180 bottom
LED1  19.68,75.56 180 top
LED2  31.11,75.56 180 top
LED3  46.35,75.56 180 top
LED4  62.87,75.56 180 top
R1  26.67,17.78 90 top
R2  31.75,22.86 90 top
R3  9.53,17.78 90 top
R4  14.61,22.86 90 top
R5  17.14,17.78 90 top
R6  22.23,22.86 90 top
R7  9.53,34.29 90 top
R8  14.61,39.37 90 top
R9  18.41,34.29 90 top
R10  23.5,39.37 90 top
R11  34.29,17.78 90 top
R12  39.37,22.86 90 top
R13  10.79,57.15 90 top
R14  15.88,62.23 90 top
R15  27.3,34.29 90 top
R16  13.97,73.66 0 top
R17  32.38,39.37 90 top
R18  36.2,34.29 90 top
R19  41.27,39.37 90 top
R20  20.95,57.15 90 top
R21  26.04,62.23 90 top
R22  25.4,73.66 0 top
R23  26.04,29.21 0 top
R24  43.18,29.21 0 top
R25  60.33,29.21 0 top
R26  77.47,22.86 270 top
R64  43.81,17.78 90 top
R65  48.9,22.86 90 top
R66  51.44,17.78 90 top
R67  56.52,22.86 90 top
R68  45.09,34.29 90 top
R69  50.16,39.37 90 top
R70  53.98,34.29 90 top
R71  59.05,39.37 90 top
R72  46.35,57.15 90 top
R73  51.44,62.23 90 top
R74  40.64,74.3 0 top
R75  38.73,57.15 90 top
R76  43.81,62.23 90 top
R77  31.11,57.15 90 top
R78  36.2,62.23 90 top
R79  60.96,17.78 90 top
R80  66.04,22.86 90 top
R81  68.58,17.78 90 top
R82  73.66,22.86 90 top
R83  62.87,34.29 90 top
R84  67.94,39.37 90 top
R85  71.75,34.29 90 top
R86  76.83,39.37 90 top
R87  71.75,57.15 90 top
R88  76.83,62.23 90 top
R89  57.15,74.3 0 top
R90  64.14,57.15 90 top
R91  69.22,62.23 90 top
R92  56.52,57.15 90 top
R93  61.59,62.23 90 top
R103  5.08,53.98 90 top
R104  64.14,69.85 90 top
R105  71.12,71.12 90 top
T1  27.94,12.06 180 top
T2  31.75,12.06 180 top
T3  30.48,27.94 180 top
T4  39.37,12.06 180 top
T5  35.56,12.06 180 top
T6  38.1,27.94 180 top
T7  10.79,12.06 180 top
T8  14.61,12.06 180 top
T9  13.34,27.94 180 top
T10  22.23,12.06 180 top
T11  18.41,12.06 180 top
T12  20.95,27.94 180 top
T13  17.14,27.94 180 top
T14  13.34,44.45 180 top
T15  22.23,44.45 180 top
T16  34.29,27.94 180 top
T17  31.11,44.45 180 top
T18  40.01,44.45 180 top
T19  12.06,51.44 180 top
T20  15.88,51.44 180 top
T21  14.61,67.31 180 top
T22  10.79,69.85 180 top
T23  22.23,51.44 180 top
T24  26.04,51.44 180 top
T25  24.77,67.31 180 top
T26  19.68,69.85 180 top
T75  45.09,12.06 180 top
T76  48.9,12.06 180 top
T77  47.62,27.94 180 top
T78  56.52,12.06 180 top
T79  52.7,12.06 180 top
T80  55.24,27.94 180 top
T81  51.44,27.94 180 top
T82  48.9,44.45 180 top
T83  57.78,44.45 180 top
T84  47.62,51.44 180 top
T85  51.44,51.44 180 top
T86  50.16,67.31 180 top
T87  38.73,69.85 180 top
T88  40.01,51.44 180 top
T89  43.81,51.44 180 top
T90  42.55,67.31 180 top
T91  32.38,51.44 180 top
T92  36.2,51.44 180 top
T93  34.92,67.31 180 top
T94  62.23,12.06 180 top
T95  66.04,12.06 180 top
T96  64.77,27.94 180 top
T97  73.66,12.06 180 top
T98  69.85,12.06 180 top
T99  72.39,27.94 180 top
T100  68.58,27.94 180 top
T101  66.67,44.45 180 top
T102  75.56,44.45 180 top
T103  73.03,51.44 180 top
T104  76.83,51.44 180 top
T105  75.56,67.31 180 top
T106  55.24,69.85 180 top
T107  65.41,51.44 180 top
T108  69.22,51.44 180 top
T109  67.94,67.31 180 top
T110  57.78,51.44 180 top
T111  61.59,51.44 180 top
T112  60.33,67.31 180 top
U$46  [T1]  82.55,56.52 0 top

### Tracks (layer width: path | path; a pad name or v marks a point on that pad's centre or on a via)
A  (via drill 0.61 pad 1.02)
  Top 0.406: T93.3 34.92,68.35 34.92,69.85 | T112.3 60.33,68.35 v60.33,70.48 61.59,70.48 63.88,68.2 R104.1
  Top 1.016: v34.92,70.48 34.92,69.85 32.38,69.85
  Bottom 0.305: J1.1 J1.2
  Bottom 0.406: 81.28,6.99 81.28,8.89 84.45,12.06 84.45,62.23 76.2,70.48 v60.33,70.48 57.78,70.48 56.64,71.63 J1.1 | J1.2 50.16,71.75 48.9,70.48 v34.92,70.48
  Bottom 1.27: 81.28,1.27 81.28,6.99
ALU_A  (via drill 0.61 pad 1.02)
  Top 0.406: T21.3 14.61,68.35 v14.61,69.22 | v5.08,63.5 2.54,60.96 2.54,10.16 8.89,3.81 10.79,3.81 v12.7,1.91
  Bottom 0.406: v14.61,69.22 10.79,69.22 v5.08,63.5
  Bottom 1.27: 12.7,1.27 v12.7,1.91 12.7,6.99
ALU_PC  (via drill 0.61 pad 1.02)
  Top 0.406: T25.3 24.77,68.35 v24.77,69.85 | v5.08,65.41 1.27,61.59 1.27,9.53 8.89,1.91 v10.16,1.91
  Bottom 0.406: v5.08,65.41 10.16,70.48 24.13,70.48 v24.77,69.85
  Bottom 1.27: 10.16,1.27 v10.16,1.91 10.16,6.99
ALU_Q0  (via drill 0.61 pad 1.02)
  Top 0.406: T75.2 44.09,9.8 v43.81,9.53
  Bottom 0.406: 50.8,6.99 50.8,8.26 49.53,9.53 v43.81,9.53
  Bottom 1.27: 50.8,6.99 50.8,1.27
ALU_Q1  (via drill 0.61 pad 1.02)
  Top 0.406: T94.2 61.24,9.8 v53.34,1.91
  Bottom 1.27: 53.34,1.27 v53.34,1.91 53.34,6.99
D_OUT  (via drill 0.61 pad 1.02)
  Top 0.406: T90.3 42.55,68.35 42.55,69.85 | T109.3 67.94,68.35 67.94,69.22 | v67.94,71.75 67.94,69.22 | R105.1 70.87,69.22 67.94,69.22
  Top 1.016: v42.55,71.75 42.55,69.85
  Bottom 0.305: J2.2 J2.1
  Bottom 0.406: 83.82,6.99 83.82,9.53 85.72,11.43 85.72,62.87 76.83,71.75 v67.94,71.75 59.69,71.75 57.78,73.66 J2.2 | J2.1 50.16,73.66 48.26,71.75 v42.55,71.75
  Bottom 1.27: 83.82,1.27 83.82,6.99
GND  (via drill 0.61 pad 1.02, 2.54 pad 5.08)
  Top 0.406: T22.3 10.79,70.89 v10.79,71.75 | T26.3 19.68,70.89 v19.68,71.75 | T87.3 38.73,70.89 v38.73,71.75
  Top 0.61: T7.3 10.79,13.11 v10.79,13.97 | T8.3 14.61,13.11 v14.61,13.97 | T1.3 27.94,13.11 v27.94,13.97 | T2.3 31.75,13.11 v31.75,13.97 | T75.3 45.09,13.11 v45.09,13.97 | T76.3 48.9,13.11 v48.9,13.97 | T94.3 62.23,13.11 v62.23,13.97 | T95.3 66.04,13.11 v66.04,13.97 | T9.1 14.28,25.73 v14.61,25.4 R4.2 C8.2 | v9.53,25.4 C7.2 | T12.1 21.89,25.73 v22.23,25.4 R6.2 | C17.2 R2.2 v31.75,25.4 31.42,25.73 T3.1 | C43.2 R65.2 v48.9,25.4 48.56,25.73 T77.1 | C55.2 R80.2 v66.04,25.4 65.71,25.73 T96.1 | T99.1 73.33,25.73 v73.66,25.4 R82.2 | T80.1 56.19,25.73 v56.52,25.4 R67.2 | v43.81,25.4 C42.2 | T6.1 39.04,25.73 v39.37,25.4 R12.2 | v26.67,25.4 C16.2 | v60.96,25.4 C54.2 | T13.3 17.14,28.98 v17.14,29.84 | T16.3 34.29,28.98 v34.29,29.84 | T81.3 51.44,28.98 v51.44,29.84 | T100.3 68.58,28.98 v68.58,29.84 | T14.1 14.28,42.24 v14.61,41.91 R8.2 | T15.1 23.16,42.24 v23.5,41.91 R10.2 | T17.1 32.05,42.24 v32.38,41.91 R17.2 | T18.1 40.95,42.24 v41.27,41.91 R19.2 | T82.1 49.84,42.24 v50.16,41.91 R69.2 | T83.1 58.73,42.24 v59.05,41.91 R71.2 | T101.1 67.61,42.24 v67.94,41.91 R84.2 | T102.1 76.5,42.24 v76.83,41.91 R86.2 | v9.53,41.91 C9.2 | v18.41,41.91 C10.2 | v27.3,41.91 C18.2 | v36.2,41.91 C19.2 | v45.09,41.91 C44.2 | v53.98,41.91 C45.2 | v62.87,41.91 C56.2 | v71.75,41.91 C57.2 | T109.1 68.89,65.1 v69.22,64.77 R91.2 | T105.1 76.5,65.1 v76.83,64.77 R88.2 | T112.1 61.27,65.1 v61.59,64.77 R93.2 | v64.14,64.77 C65.2 | v71.75,64.77 C66.2 | v56.52,64.77 C58.2 | T86.1 51.1,65.1 v51.44,64.77 R73.2 | T93.1 35.87,65.1 v36.2,64.77 R78.2 | v38.73,64.77 C67.2 | v31.11,64.77 C46.2 | T90.1 43.48,65.1 v43.81,64.77 R76.2 | T21.1 15.54,65.1 v15.88,64.77 R14.2 | T25.1 25.7,65.1 v26.04,64.77 R21.2 26.04,63.5
  Top 0.61: v20.95,64.77 C20.2 | v10.79,64.77 C11.2 | v46.35,64.77 C68.2 | T19.3 12.06,52.48 v12.06,53.34 | T20.3 15.88,52.48 v15.88,53.34 | T23.3 22.23,52.48 v22.23,53.34 | T24.3 26.04,52.48 v26.04,53.34 | T91.3 32.38,52.48 v32.38,53.34 | T92.3 36.2,52.48 v36.2,53.34 | T88.3 40.01,52.48 v40.01,53.34 | T89.3 43.81,52.48 v43.81,53.34 | T84.3 47.62,52.48 v47.62,53.34 | T85.3 51.44,52.48 v51.44,53.34 | T110.3 57.78,52.48 v57.78,53.34 | T111.3 61.59,52.48 v61.59,53.34 | T104.3 76.83,52.48 v76.83,53.34 | T103.3 73.03,52.48 v73.03,53.34 | T108.3 69.22,52.48 v69.22,53.34 | T107.3 65.41,52.48 v65.41,53.34 | T98.3 69.85,13.11 v69.85,13.97 | T97.3 73.66,13.11 v73.66,13.97 | T11.3 18.41,13.11 v18.41,13.97 | T10.3 22.23,13.11 v22.23,13.97 | T5.3 35.56,13.11 v35.56,13.97 | T4.3 39.37,13.11 v39.37,13.97 | T79.3 52.7,13.11 v52.7,13.97 | T78.3 56.52,13.11 v56.52,13.97
  Top 0.813: v46.35,64.77 46.35,69.22 48.9,71.75 54.61,71.75 55.22,71.14 T106.3 | v15.88,64.77 16.51,65.41 16.51,71.12 17.14,71.75 v19.68,71.75 | v76.83,64.77 83.19,71.12 v83.19,74.3 | v10.79,71.75 6.35,71.75 v3.81,74.3
  Bottom 0.61: v10.79,71.75 v19.68,71.75 v38.73,71.75
  Bottom 0.813: 39.37,6.99 38.1,6.99 | 39.37,6.99 40.64,6.99 | v39.37,13.97 39.37,6.99
  Bottom 1.27: v10.79,13.97 v14.61,13.97 v18.41,13.97 v22.23,13.97 v27.94,13.97 v31.75,13.97 v35.56,13.97 v39.37,13.97 v45.09,13.97 v48.9,13.97 v52.7,13.97 v56.52,13.97 v62.23,13.97 v66.04,13.97 v69.85,13.97 v73.66,13.97 81.28,13.97 | 68.58,25.4 v66.04,25.4 v60.96,25.4 v56.52,25.4 51.44,25.4 | 68.58,25.4 v73.66,25.4 81.28,25.4 | 51.44,25.4 v48.9,25.4 v43.81,25.4 v39.37,25.4 34.29,25.4 | 34.29,25.4 v31.75,25.4 v26.67,25.4 v22.23,25.4 17.14,25.4 | 17.14,25.4 v14.61,25.4 v9.53,25.4 | 17.14,25.4 v17.14,29.84 | 34.29,25.4 v34.29,29.84 | 51.44,25.4 v51.44,29.84 | 68.58,25.4 v68.58,29.84 | v9.53,41.91 v14.61,41.91 v18.41,41.91 v23.5,41.91 v27.3,41.91 v32.38,41.91 v36.2,41.91 v41.27,41.91 v45.09,41.91 v50.16,41.91 v53.98,41.91 v59.05,41.91 v62.87,41.91 v67.94,41.91 v71.75,41.91 v76.83,41.91 81.28,41.91 | v10.79,64.77 v15.88,64.77 v20.95,64.77 v26.04,64.77 v31.11,64.77 v36.2,64.77 v38.73,64.77 v43.81,64.77 v46.35,64.77 v51.44,64.77 v56.52,64.77 v61.59,64.77 v64.14,64.77 v69.22,64.77 v71.75,64.77 v76.83,64.77 81.28,60.33 81.28,53.34 | 81.28,13.97 81.28,25.4 | 81.28,25.4 81.28,41.91 | 81.28,41.91 81.28,53.34 | v12.06,53.34 v15.88,53.34 v22.23,53.34 v26.04,53.34 v32.38,53.34 v36.2,53.34 v40.01,53.34 v43.81,53.34 v47.62,53.34 v51.44,53.34 v57.78,53.34 v61.59,53.34 v65.41,53.34 v69.22,53.34 v73.03,53.34 v76.83,53.34 81.28,53.34 | 81.28,13.97 81.28,12.06 78.74,9.53 78.74,6.99 | 78.74,6.99 78.74,5.71 | 78.74,5.71 78.74,1.27 | 76.2,6.99 76.2,1.27 | 78.74,6.99 76.2,6.99 | 73.66,5.71 73.66,6.99 76.2,6.99 | 73.66,5.71 73.66,1.27 | 38.1,6.99 38.1,1.27 | 40.64,6.99 40.64,1.27 | 78.74,5.71 73.66,5.71
  pour Bottom (isolate 0.356): 73.03,3.81 73.03,9.53 71.75,10.79 42.55,10.79 41.27,9.53 41.27,4.45 40.64,3.81 38.1,3.81 37.47,4.45 37.47,9.53 36.2,10.79 12.7,10.79 8.26,15.24 8.26,16.51 76.83,16.51 79.38,19.05 79.38,21.59 78.11,22.86 8.26,22.86 8.26,27.94 76.83,27.94 76.83,30.48 74.3,33.02 74.3,39.37 8.26,39.37 8.26,44.45 53.98,44.45 55.24,43.18 59.05,43.18 60.33,41.91 79.38,41.91 80.64,43.18 80.64,52.07 70.48,52.07 69.22,50.8 32.38,50.8 31.75,51.44 29.21,51.44 28.57,50.8 8.26,50.8 8.26,55.88 74.3,55.88 74.3,62.23 8.26,62.23 12.06,66.04 26.67,66.04 27.94,67.31 77.47,67.31 83.19,61.59 83.19,13.34 78.74,8.89 78.74,3.81
  pour Top (isolate 0.356): 0.64,63.5 0.64,77.47 15.24,77.47 15.24,76.2 11.43,76.2 9.53,74.3 9.53,72.39
  pour Bottom (isolate 0.356): 0.64,77.47 0.64,66.67 10.16,76.2 15.24,76.2 15.24,77.47
  pour Bottom (isolate 0.356): 86.36,77.47 86.36,64.14 77.47,73.03 66.67,73.03 66.67,77.47
  pour Top (isolate 0.356): 86.36,77.47 66.67,77.47 66.67,75.56 72.39,75.56 73.66,74.3 73.66,71.12 76.83,71.12 78.74,69.22 78.74,60.96 86.36,60.96
I_A  (via drill 0.61 pad 1.02)
  Top 0.406: T7.2 9.8,10.52 v11.43,8.89
  Bottom 0.406: 25.4,6.99 25.4,8.26 24.77,8.89 v11.43,8.89
  Bottom 1.27: 25.4,6.99 25.4,1.27
I_PC  (via drill 0.61 pad 1.02)
  Top 0.406: v27.94,1.91 27.94,8.26 26.95,9.25 T1.2
  Bottom 1.27: 27.94,6.99 v27.94,1.91 27.94,1.27
L_ACC  (via drill 0.61 pad 1.02)
  Top 0.406: T8.2 13.61,10.52 14.61,9.53 17.14,9.53 | T11.2 17.42,9.8 17.14,9.53 | 17.14,9.53 17.14,7.62 v22.86,1.91
  Bottom 1.27: 22.86,1.27 v22.86,1.91 22.86,6.99
L_PC  (via drill 0.61 pad 1.02)
  Top 0.406: T2.2 30.76,9.88 31.11,9.53 | T5.2 34.57,9.8 34.29,9.53 31.11,9.53 | v30.48,1.91 30.48,8.89 31.11,9.53 | 31.11,9.53 31.75,9.53
  Bottom 1.27: 30.48,1.27 v30.48,1.91 30.48,6.99
L_T0  (via drill 0.61 pad 1.02)
  Top 0.406: T76.2 47.9,9.88 48.26,9.53 | T79.2 51.71,9.8 51.44,9.53 48.26,9.53 | v48.26,1.91 48.26,9.53
  Bottom 1.27: 48.26,1.27 v48.26,1.91 48.26,6.99
L_T1  (via drill 0.61 pad 1.02)
  Top 0.406: T95.2 65.05,9.88 65.41,9.53 | T98.2 68.86,9.8 68.58,9.53 65.41,9.53 | 65.41,9.53 63.5,9.53 v55.88,1.91
  Bottom 1.27: 55.88,1.27 v55.88,1.91 55.88,6.99
N$1
  Top 2: 20,-1 -1,-1 -1,20
N$2
  Top 2: 66.97,-1 87.97,-1 87.97,20
N$3
  Top 2: 20,79.09 -1,79.09 -1,58.09
N$4
  Top 2: 87.97,58.09 87.97,79.09 66.97,79.09
N$5
  Bottom 2: 20,-1 -1,-1 -1,20
N$6
  Bottom 2: 66.97,-1 87.97,-1 87.97,20
N$7
  Bottom 2: 20,79.09 -1,79.09 -1,58.09
N$8
  Bottom 2: 87.97,58.09 87.97,79.09 66.97,79.09
N$9
  Top 0.406: T1.1 28.88,11.1 29.21,11.43 29.21,15.24 | 29.21,15.24 D9.1 | T2.1 32.69,11.1 33.02,11.43 33.02,14.61 32.38,15.24 29.21,15.24
  Top 0.61: R1.1 D9.1 C5.1
N$10
  Top 0.61: D9.2 D10.1
N$11
  Top 0.406: T7.1 12.06,11.38 12.06,15.24 | T8.1 15.88,11.38 15.88,14.61 15.24,15.24 12.06,15.24 | 12.06,15.24 D1.1
  Top 0.61: R3.1 D1.1 C1.1
N$12
  Top 0.61: D1.2 D2.1
N$13
  Top 0.406: R2.1 31.75,21.59 29.21,24.13 D10.2
  Top 0.61: C5.2 R2.1 | T3.2 29.49,25.68 29.21,25.4 D10.2
N$14
  Top 0.406: R4.1 14.61,21.59 12.06,24.13 D2.2
  Top 0.61: C1.2 R4.1 | T9.2 12.34,25.68 12.06,25.4 D2.2
N$15
  Top 0.61: D6.1 D5.2
N$17
  Top 0.406: 19.68,15.24 19.68,11.43 19.36,11.1 T11.1 | 19.68,15.24 D3.1 | 19.68,15.24 22.86,15.24 23.5,14.61 23.5,11.43 23.16,11.1 T10.1
  Top 0.61: R5.1 D3.1 C2.1
N$18
  Top 0.61: D3.2 D4.1
N$19
  Top 0.406: R6.1 22.23,21.59 19.68,24.13 D4.2
  Top 0.61: C2.2 R6.1 | T12.2 19.96,25.68 19.68,25.4 D4.2
N$20
  Top 0.406: R8.1 14.61,38.1 12.06,40.64 D6.2
  Top 0.61: R8.1 C3.2 | T14.2 12.34,42.19 12.06,41.91 D6.2
N$21
  Top 0.61: D8.1 D7.2
N$22
  Top 0.406: R10.1 23.5,38.1 20.95,40.64 D8.2
  Top 0.61: R10.1 C4.2 | T15.2 21.23,42.19 20.95,41.91 D8.2
N$23
  Top 0.406: R9.1 18.16,32.64 16.51,34.29 16.51,44.45 | 15.49,45.47 T14.3 | T12.3 20.95,28.96 D7.1
  Top 0.61: C4.1 D7.1 R9.1
  Top 1.27: 16.51,44.45 15.49,45.47
N$24
  Top 0.406: T13.1 18.09,26.98 18.41,27.3 18.41,30.48 17.78,31.11 14.61,31.11 | C3.1 14.61,31.11 | 14.61,31.11 8.26,31.11 7.62,31.75 7.62,43.81 9.53,45.72 9.53,47.62 | T20.2 14.61,50.14 14.61,47.62 | 9.53,47.62 14.61,47.62 | T15.3 22.2,45.74 21.59,46.35 17.78,46.35 16.51,47.62 14.61,47.62 | T22.2 8.26,67.28 8.26,53.98 9.53,52.7 9.53,47.62
  Top 0.61: C3.1 D5.1 R7.1
N$25
  Top 0.406: T22.1 12.06,69.16 12.06,73.41 R16.1
N$26  (via drill 0.61 pad 1.02)
  Top 0.406: T3.3 30.45,29.82 v30.48,29.84 31.11,29.84 33.02,27.94 33.02,27.3 33.3,27.03 T16.2 | T4.2 38.38,9.88 38.73,9.53 41.27,9.53 41.91,10.16 41.91,15.24 41.27,15.88 41.27,28.57 v40.64,29.21
  Top 0.61: v40.64,29.21 R24.1
  Bottom 0.406: v30.48,29.84 32.38,31.75 38.1,31.75 v40.64,29.21
N$27
  Top 0.406: 36.83,15.24 36.83,11.43 36.5,11.1 T5.1 | 36.83,15.24 D13.1 | 36.83,15.24 40.01,15.24 40.64,14.61 40.64,11.43 40.31,11.1 T4.1
  Top 0.61: R11.1 D13.1 C12.1
N$28
  Top 0.61: D13.2 D14.1
N$29
  Top 0.813: R16.2 17.53,75.56
  Top 1.27: 17.53,75.56 LED1.2 | LED1.2 18.41,76.83 | LED1.2 18.41,73.66
  Bottom 1.27: LED1.2 18.41,76.83
N$30
  Top 0.406: T19.1 13.01,50.47 13.34,50.8 13.34,54.61 | 13.34,54.61 D11.1 | T20.1 16.82,50.47 17.14,50.8 17.14,53.98 16.51,54.61 13.34,54.61
  Top 0.61: R13.1 D11.1 C6.1
N$31
  Top 0.61: D12.1 D11.2
N$32
  Top 0.406: R14.1 15.88,60.96 13.34,63.5 D12.2
  Top 0.61: R14.1 C6.2 | T21.2 13.61,65.05 13.34,64.77 D12.2
N$33
  Top 0.406: R12.1 39.37,21.59 36.83,24.13 D14.2
  Top 0.61: C12.2 R12.1 | T6.2 37.11,25.68 36.83,25.4 D14.2
N$34
  Top 0.61: D16.1 D15.2
N$35
  Top 0.406: R17.1 32.38,38.1 29.84,40.64 D16.2
  Top 0.61: R17.1 C13.2 | D16.2 29.84,41.91 30.12,42.19 T17.2
N$36
  Top 0.61: D18.1 D17.2
N$37
  Top 0.406: R19.1 41.27,38.1 38.73,40.64 D18.2
  Top 0.61: R19.1 C14.2 | T18.2 39.01,42.19 38.73,41.91 D18.2
N$38
  Top 0.406: R18.1 35.94,32.64 34.29,34.29 34.29,44.45 | 33.27,45.47 T17.3 | T6.3 38.08,29.82 38.73,30.48 D17.1
  Top 0.61: C14.1 D17.1 R18.1
  Top 1.27: 34.29,44.45 33.27,45.47
N$39
  Top 0.406: C13.1 32.38,31.11 | 32.38,31.11 34.92,31.11 35.56,30.48 35.56,27.3 35.23,26.98 T16.1 | 32.38,31.11 26.04,31.11 25.4,31.75 25.4,46.99 | T24.2 25.04,48.62 25.4,48.26 25.4,46.99 | T18.3 35.81,45.47 34.29,46.99 25.4,46.99 | 25.4,46.99 23.5,46.99 22.86,47.62 19.05,47.62 18.41,48.26 18.41,68.56 T26.2
  Top 0.61: C13.1 D15.1 R15.1
N$40
  Top 0.406: T23.1 23.16,50.47 23.5,50.8 23.5,54.61 | 23.5,54.61 D19.1 | T24.1 26.98,50.47 27.3,50.8 27.3,53.98 26.67,54.61 23.5,54.61
  Top 0.61: R20.1 D19.1 C15.1
N$41
  Top 0.61: D20.1 D19.2
N$42
  Top 0.406: R21.1 26.04,60.96 23.5,63.5 D20.2
  Top 0.61: R21.1 C15.2 | T25.2 23.77,65.05 23.5,64.77 D20.2
N$43
  Top 0.406: T26.1 20.95,69.16 20.95,70.87 R22.1
N$44
  Top 0.813: R22.2 28.96,75.56
  Top 1.27: 28.96,75.56 LED2.2 | LED2.2 29.84,76.83 | LED2.2 29.84,73.66
  Bottom 1.27: LED2.2 29.84,76.83
N$45  (via drill 0.61 pad 1.02)
  Top 0.406: T9.3 13.34,28.98 v13.34,29.84 13.97,29.84 15.88,27.94 15.88,27.3 16.15,27.03 T13.2 | T10.2 21.23,9.88 21.59,9.53 24.13,9.53 24.77,10.16 24.77,15.24 24.13,15.88 24.13,28.57 v23.5,29.21
  Top 0.61: v23.5,29.21 R23.1
  Bottom 0.406: v13.34,29.84 15.24,31.75 20.95,31.75 v23.5,29.21
N$47  (via drill 0.61 pad 1.02)
  Top 1.27: 33.02,3.81 v33.02,5.71 33.02,6.99
  Bottom 1.27: 33.02,1.27 v33.02,5.71 33.02,6.99
N$48  (via drill 0.61 pad 1.02)
  Top 1.27: 35.56,6.99 v35.56,5.71 35.56,3.81
  Bottom 1.27: 35.56,1.27 v35.56,5.71 35.56,6.99
N$51  (via drill 0.61 pad 1.02)
  Top 1.27: 45.72,3.81 v45.72,5.71 45.72,6.99
  Bottom 1.27: 45.72,1.27 v45.72,5.71 45.72,6.99
N$53  (via drill 0.61 pad 1.02)
  Top 1.27: 43.18,6.99 v43.18,5.71 43.18,3.81
  Bottom 1.27: 43.18,1.27 v43.18,5.71 43.18,6.99
N$93
  Top 0.406: T75.1 46.02,11.1 46.35,11.43 46.35,15.24 | 46.35,15.24 D53.1 | T76.1 49.84,11.1 50.16,11.43 50.16,14.61 49.53,15.24 46.35,15.24
  Top 0.61: R64.1 D53.1 C37.1
N$94
  Top 0.61: D53.2 D54.1
N$95
  Top 0.406: R65.1 48.9,21.59 46.35,24.13 D54.2
  Top 0.61: C37.2 R65.1 | T77.2 46.63,25.68 46.35,25.4 D54.2
N$96  (via drill 0.61 pad 1.02)
  Top 0.406: T77.3 47.6,29.82 v47.62,29.84 48.26,29.84 50.16,27.94 50.16,27.3 50.44,27.03 T81.2 | T78.2 55.52,9.88 55.88,9.53 58.42,9.53 59.05,10.16 59.05,15.24 58.42,15.88 58.42,28.57 v57.78,29.21
  Top 0.61: v57.78,29.21 R25.1
  Bottom 0.406: v47.62,29.84 49.53,31.75 55.24,31.75 v57.78,29.21
N$97
  Top 0.406: 53.98,15.24 53.98,11.43 53.65,11.1 T79.1 | 53.98,15.24 D55.1 | 53.98,15.24 57.15,15.24 57.78,14.61 57.78,11.43 57.45,11.1 T78.1
  Top 0.61: C38.1 D55.1 R66.1
N$98
  Top 0.61: D55.2 D56.1
N$99
  Top 0.406: R67.1 56.52,21.59 53.98,24.13 D56.2
  Top 0.61: C38.2 R67.1 | T80.2 54.25,25.68 53.98,25.4 D56.2
N$100
  Top 0.61: D58.1 D57.2
N$101
  Top 0.406: R69.1 50.16,38.1 47.62,40.64 D58.2
  Top 0.61: R69.1 C39.2 | T82.2 47.9,42.19 47.62,41.91 D58.2
N$102
  Top 0.61: D60.1 D59.2
N$103
  Top 0.406: R71.1 59.05,38.1 56.52,40.64 D60.2
  Top 0.61: R71.1 C40.2 | T83.2 56.79,42.19 56.52,41.91 D60.2
N$104
  Top 0.406: 51.05,45.47 T82.3 | 52.07,44.45 52.07,34.29 53.72,32.64 R70.1 53.98,31.75 55.22,30.5 T80.3
  Top 0.61: C40.1 D59.1 R70.1
  Top 1.27: 52.07,44.45 51.05,45.47
N$105
  Top 0.406: T81.1 52.38,26.98 52.7,27.3 52.7,30.48 52.07,31.11 50.16,31.11 | C39.1 50.16,31.11 | 50.16,31.11 43.81,31.11 43.18,31.75 43.18,46.35 | T89.2 42.82,46.71 43.18,46.35 | T83.3 54.23,45.47 52.07,47.62 50.16,47.62 | 43.18,46.35 46.35,46.35 47.62,47.62 50.16,47.62 | T85.2 50.16,50.14 50.16,47.62 | T92.2 35.2,48.62 35.56,48.26 | 35.56,48.26 36.83,46.99 42.55,46.99 43.18,46.35 | 35.56,48.26 29.84,48.26 28.57,49.53 28.57,69.22 31.11,71.75 36.2,71.75 36.83,71.12 36.83,69.75 T87.2
  Top 0.61: R68.1 D57.1 C39.1
N$106
  Top 0.406: T84.1 48.56,50.47 48.9,50.8 48.9,54.61 | 48.9,54.61 D61.1 | T85.1 52.38,50.47 52.7,50.8 52.7,53.98 52.07,54.61 48.9,54.61
  Top 0.61: R72.1 D61.1 C41.1
N$107
  Top 0.61: D62.1 D61.2
N$108
  Top 0.406: R73.1 51.44,60.96 48.9,63.5 D62.2
  Top 0.61: R73.1 C41.2 | T86.2 49.17,65.05 48.9,64.77 D62.2
N$109
  Top 0.406: T87.1 40.01,69.16 40.01,72.39 38.99,73.41 R74.1
N$110
  Top 0.406: R74.2 43.56,75.56
  Top 1.27: 43.56,75.56 LED3.2 | LED3.2 45.09,76.83 | LED3.2 45.09,73.66
  Bottom 1.27: LED3.2 45.09,76.83
N$111
  Top 0.406: T94.1 63.17,11.1 63.5,11.43 63.5,15.24 | T95.1 66.98,11.1 67.31,11.43 67.31,14.61 66.67,15.24 63.5,15.24 | 63.5,15.24 D67.1
  Top 0.61: C49.1 D67.1 R79.1
N$112
  Top 0.406: T89.1 44.76,50.47 45.09,50.8 45.09,53.98 44.45,54.61 41.27,54.61 | T88.1 40.95,50.47 41.27,50.8 41.27,54.61 | 41.27,54.61 D63.1
  Top 0.61: R75.1 D63.1 C47.1
N$113
  Top 0.61: D64.1 D63.2
N$114
  Top 0.406: R76.1 43.81,60.96 41.27,63.5 D64.2
  Top 0.61: R76.1 C47.2 | T90.2 41.55,65.05 41.27,64.77 D64.2
N$115
  Top 0.61: D67.2 D68.1
N$116
  Top 0.406: T91.1 33.33,50.47 33.66,50.8 33.66,54.61 | 33.66,54.61 D65.1 | T92.1 37.13,50.47 37.47,50.8 37.47,53.98 36.83,54.61 33.66,54.61
  Top 0.61: R77.1 D65.1 C48.1
N$117
  Top 0.61: D66.1 D65.2
N$118
  Top 0.406: R78.1 36.2,60.96 33.66,63.5 D66.2
  Top 0.61: R78.1 C48.2 | T93.2 33.93,65.05 33.66,64.77 D66.2
N$119
  Top 0.406: R80.1 66.04,21.59 63.5,24.13 D68.2
  Top 0.61: C49.2 R80.1 | T96.2 63.78,25.68 63.5,25.4 D68.2
N$120  (via drill 0.61 pad 1.02)
  Top 0.406: T100.2 67.59,27.03 67.31,27.3 67.31,27.94 65.41,29.84 v64.77,29.84 64.75,29.82 T96.3 | T97.2 72.67,9.88 73.03,9.53 75.56,9.53 76.2,10.16 76.2,15.24 75.56,15.88 75.56,28.57
  Top 0.61: v74.93,29.21 75.56,28.57 77.47,26.67 R26.1
  Bottom 0.406: v64.77,29.84 66.67,31.75 72.39,31.75 v74.93,29.21
N$121
  Top 0.406: 71.12,15.24 71.12,11.43 70.79,11.1 T98.1 | 71.12,15.24 D69.1 | 71.12,15.24 74.3,15.24 74.93,14.61 74.93,11.43 74.6,11.1 T97.1
  Top 0.61: C50.1 D69.1 R81.1
N$122
  Top 0.61: D69.2 D70.1
N$123
  Top 0.406: R82.1 73.66,21.59 71.12,24.13 D70.2
  Top 0.61: C50.2 R82.1 | T99.2 71.4,25.68 71.12,25.4 D70.2
N$124
  Top 0.61: D72.1 D71.2
N$125
  Top 0.406: R84.1 67.94,38.1 65.41,40.64 D72.2
  Top 0.61: R84.1 C51.2 | T101.2 65.68,42.19 65.41,41.91 D72.2
N$126
  Top 0.61: D74.1 D73.2
N$127
  Top 0.406: R86.1 76.83,38.1 74.3,40.64 D74.2
  Top 0.61: R86.1 C52.2 | T102.2 74.57,42.19 74.3,41.91 D74.2
N$128
  Top 0.406: 68.83,45.47 T101.3 | 69.85,44.45 69.85,34.29 71.5,32.64 R85.1 71.75,31.11 72.36,30.5 T99.3
  Top 0.61: R85.1 D73.1 C52.1
  Top 1.27: 69.85,44.45 68.83,45.47
N$129
  Top 0.406: 67.94,31.11 69.22,31.11 69.85,30.48 69.85,27.3 69.52,26.98 T100.1 | C51.1 67.94,31.11 | 67.94,31.11 61.59,31.11 60.96,31.75 60.96,46.99 | T111.2 60.6,49.25 60.96,48.9 60.96,46.99 | T102.3 75.54,45.74 74.93,46.35 | T104.2 75.84,49.17 74.93,48.26 74.93,46.35 | 60.96,46.99 64.77,46.99 65.41,47.62 67.94,47.62 | 67.94,47.62 70.48,47.62 71.75,46.35 74.93,46.35 | T108.2 68.2,50.42 67.94,50.16 67.94,47.62 | 60.96,46.99 56.52,46.99 53.98,49.53 53.98,68.56 T106.2
  Top 0.61: R83.1 D71.1 C51.1
N$130
  Top 0.406: T103.1 74.3,50.75 74.3,54.61 | 74.3,54.61 D75.1 | T104.1 78.11,50.75 78.11,53.98 77.47,54.61 74.3,54.61
  Top 0.61: R87.1 D75.1 C53.1
N$131
  Top 0.61: D76.1 D75.2
N$132
  Top 0.406: R88.1 76.83,60.96 74.3,63.5 D76.2
  Top 0.61: R88.1 C53.2 | T105.2 74.57,65.05 74.3,64.77 D76.2
N$133
  Top 0.406: T106.1 56.52,69.16 56.52,72.39 55.5,73.41 R89.1
N$134
  Top 0.406: R89.2 60.07,75.56
  Top 1.27: 60.07,75.56 LED4.2 | LED4.2 61.59,76.83 | LED4.2 61.59,73.66
  Bottom 1.27: LED4.2 61.59,76.83
N$135
  Top 0.406: T107.1 66.67,50.75 66.67,54.61 | 66.67,54.61 D77.1 | T108.1 70.16,50.47 70.48,50.8 70.48,53.98 69.85,54.61 66.67,54.61
  Top 0.61: R90.1 D77.1 C59.1
N$136
  Top 0.61: D78.1 D77.2
N$137
  Top 0.406: R91.1 69.22,60.96 66.67,63.5 D78.2
  Top 0.61: R91.1 C59.2 | T109.2 66.95,65.05 66.67,64.77 D78.2
N$138
  Top 0.406: T110.1 58.73,50.47 59.05,50.8 59.05,54.61 | 59.05,54.61 D79.1 | T111.1 62.53,50.47 62.87,50.8 62.87,53.98 62.23,54.61 59.05,54.61
  Top 0.61: R92.1 D79.1 C60.1
N$139
  Top 0.61: D80.1 D79.2
N$140
  Top 0.406: R93.1 61.59,60.96 59.05,63.5 D80.2
  Top 0.61: R93.1 C60.2 | T112.2 59.33,65.05 59.05,64.77 D80.2
O_ACC  (via drill 0.61 pad 1.02)
  Top 0.406: T19.2 11.05,50.42 11.05,49.78 v10.79,49.53 | v5.71,49.53 3.81,47.62 3.81,10.79 9.53,5.08 12.06,5.08 v15.24,1.91
  Bottom 0.406: v5.71,49.53 v10.79,49.53
  Bottom 1.27: 15.24,1.27 v15.24,1.91 15.24,6.99
O_PC  (via drill 0.61 pad 1.02)
  Top 0.406: T23.2 21.21,50.42 v19.68,48.9 | v6.99,48.26 5.08,46.35 5.08,11.43 10.16,6.35 13.34,6.35 v17.78,1.91
  Bottom 0.406: v19.68,48.9 19.05,48.26 v6.99,48.26
  Bottom 1.27: 17.78,1.27 v17.78,1.91 17.78,6.99
OA_T0  (via drill 0.61 pad 1.02)
  Top 0.406: T91.2 30.73,50.42 30.48,50.16 v29.84,50.16 | v78.11,43.81 79.38,42.55 79.38,9.53 78.11,8.26 64.77,8.26 v58.42,1.91
  Top 0.813: v29.84,50.16 29.84,50.8
  Top 1.016: 29.84,50.8 29.84,52.39
  Bottom 0.406: v29.84,50.16 31.11,48.9 36.2,48.9 37.47,47.62 43.81,47.62 45.09,46.35 53.98,46.35 55.24,45.09 59.69,45.09 60.96,43.81 v78.11,43.81
  Bottom 1.27: 58.42,1.27 v58.42,1.91 58.42,6.99
OA_T1  (via drill 0.61 pad 1.02)
  Top 0.406: T110.2 56.79,49.25 v57.15,48.9 | v76.83,47.62 81.28,47.62 83.19,45.72 83.19,7.62 80.01,4.45 68.58,4.45 v66.04,1.91
  Top 0.813: v57.15,48.9 57.78,48.26
  Top 1.016: 57.78,48.26 59.05,48.26
  Bottom 0.406: v57.15,48.9 61.59,48.9 62.87,47.62 v76.83,47.62
  Bottom 1.27: 66.04,1.27 v66.04,1.91 66.04,6.99
OD_T0  (via drill 0.61 pad 1.02)
  Top 0.406: T88.2 39.01,49.17 v38.73,48.9 | v79.38,45.09 80.64,43.81 80.64,8.89 78.74,6.99 66.04,6.99 v60.96,1.91
  Bottom 0.406: v38.73,48.9 44.45,48.9 45.72,47.62 54.61,47.62 55.88,46.35 60.33,46.35 61.59,45.09 v79.38,45.09
  Bottom 1.27: 60.96,1.27 v60.96,1.91 60.96,6.99
OD_T1  (via drill 0.61 pad 1.02)
  Top 0.406: T107.2 64.41,49.17 v64.14,48.9 | v79.38,50.8 81.92,50.8 85.72,46.99 85.72,6.35 81.28,1.91 v71.12,1.91
  Bottom 0.406: v64.14,48.9 69.85,48.9 71.12,50.16 77.47,50.16 78.11,50.8 v79.38,50.8
  Bottom 1.27: 71.12,1.27 v71.12,1.91 71.12,6.99
OQ_T0  (via drill 0.61 pad 1.02)
  Top 0.406: T84.2 46.63,49.17 v46.35,48.9 | v78.11,46.35 80.64,46.35 81.92,45.09 81.92,8.26 79.38,5.71 67.31,5.71 v63.5,1.91
  Top 0.813: v46.35,48.9 45.72,48.26
  Top 1.016: 45.72,48.26 44.45,48.26
  Bottom 0.406: v46.35,48.9 55.24,48.9 56.52,47.62 60.96,47.62 62.23,46.35 v78.11,46.35
  Bottom 1.27: 63.5,1.27 v63.5,1.91 63.5,6.99
OQ_T1  (via drill 0.61 pad 1.02)
  Top 0.406: T103.2 72.03,49.17 v71.75,48.9 | v78.74,48.9 81.92,48.9 84.45,46.35 84.45,6.99 80.64,3.17 69.85,3.17 v68.58,1.91
  Top 0.813: v71.75,48.9 72.39,48.26
  Top 1.016: 72.39,48.26 73.34,48.26
  Bottom 0.406: v78.74,48.9 v71.75,48.9
  Bottom 1.27: 68.58,1.27 v68.58,1.91 68.58,6.99
Q_OUT  (via drill 0.61 pad 1.02)
  Top 0.305: 6.99,52.07 v6.99,63.5
  Top 0.406: T86.3 50.16,68.35 v50.16,69.22 | T105.3 75.56,68.35 v75.56,69.22 | v20.32,1.91 14.61,7.62 10.79,7.62 6.35,12.06 6.35,45.09 8.26,46.99 8.26,50.8 6.99,52.07 5.33,52.07 R103.1
  Top 1.016: v75.56,69.22 73.66,69.22
  Bottom 0.305: J3.1 J3.2
  Bottom 0.406: v6.99,63.5 11.43,67.94 26.04,67.94 27.3,69.22 v50.16,69.22 51.44,69.22 51.94,69.72 J3.1 | J3.2 53.98,69.22 v75.56,69.22
  Bottom 1.27: 20.32,1.27 v20.32,1.91 20.32,6.99
VCC  (via drill 0.61 pad 1.02)
  Top 0.61: R1.2 v26.67,20.32 C16.1 | R11.2 v34.29,20.32 C17.1 | R5.2 v17.14,20.32 C8.1 | R3.2 v9.53,20.32 C7.1 | R64.2 v43.81,20.32 C42.1 | R66.2 v51.44,20.32 C43.1 | R79.2 v60.96,20.32 C54.1 | R81.2 v68.58,20.32 C55.1 | C56.1 v62.87,36.83 R83.2 | C57.1 v71.75,36.83 R85.2 | C44.1 v45.09,36.83 R68.2 | C45.1 v53.98,36.83 R70.2 | C19.1 v36.2,36.83 R18.2 | C18.1 v27.3,36.83 R15.2 | C9.1 v9.53,36.83 R7.2 | C10.1 v18.41,36.83 R9.2 | C11.1 v10.79,59.69 R13.2 | C20.1 v20.95,59.69 R20.2 | R77.2 v31.11,59.69 C46.1 | C67.1 v38.73,59.69 R75.2 | C68.1 v46.35,59.69 R72.2 | R92.2 v56.52,59.69 C58.1 | C66.1 v71.75,59.69 R87.2 | R90.2 v64.14,59.69 C65.1 | v77.47,20.32 R26.2 | v60.96,29.21 R25.2 | v43.81,29.21 R24.2 | v26.67,29.21 R23.2 | v5.08,57.15 R103.2 | R104.2 v64.14,73.66 70.23,73.66 R105.2
  Top 1.27: 20.95,76.83 LED1.1 20.95,73.66 | 32.38,76.83 LED2.1 32.38,73.66 | 47.62,76.83 LED3.1 47.62,73.66 | 64.14,76.83 LED4.1 v64.14,73.66
  Bottom 0.61: v68.58,20.32 v77.47,20.32 | 26.67,36.83 v26.67,29.21 | 43.81,36.83 v43.81,29.21 | 60.96,36.83 v60.96,29.21 | 2.54,57.15 v5.08,57.15
  Bottom 1.27: v68.58,20.32 v60.96,20.32 v51.44,20.32 v43.81,20.32 v34.29,20.32 v26.67,20.32 v17.14,20.32 v9.53,20.32 2.54,20.32 | v71.75,59.69 v64.14,59.69 v56.52,59.69 v46.35,59.69 v38.73,59.69 v31.11,59.69 v20.95,59.69 v10.79,59.69 2.54,59.69 | v71.75,36.83 v62.87,36.83 60.96,36.83 v53.98,36.83 v45.09,36.83 43.81,36.83 v36.2,36.83 v27.3,36.83 26.67,36.83 v18.41,36.83 v9.53,36.83 2.54,36.83 | 2.54,36.83 2.54,57.15 2.54,59.69 | 2.54,20.32 2.54,36.83 | 2.54,1.27 2.54,5.71 | 2.54,5.71 2.54,6.99 | 2.54,6.99 2.54,20.32 | 47.62,73.66 50.16,76.2 57.78,76.2 60.33,73.66 v64.14,73.66 LED4.1 64.14,76.83 | 32.38,73.66 47.62,73.66 | 20.95,73.66 32.38,73.66 | 20.95,73.66 10.16,73.66 2.54,66.04 2.54,59.69 | 20.95,73.66 LED1.1 20.95,76.83 | 32.38,73.66 LED2.1 32.38,76.83 | 47.62,73.66 LED3.1 47.62,76.83 | 5.08,6.99 5.08,1.27 | 2.54,6.99 5.08,6.99 | 7.62,5.71 7.62,6.99 5.08,6.99 | 7.62,5.71 7.62,1.27 | 2.54,5.71 7.62,5.71
  pour Bottom (isolate 0.356): 8.26,3.81 1.27,3.81 1.27,60.96 73.03,60.96 73.03,57.15 6.99,57.15 6.99,50.8 4.45,50.8 4.45,48.9 6.99,46.35 6.99,38.1 73.03,38.1 73.03,33.66 6.99,33.66 6.99,21.59 76.83,21.59 78.11,20.32 75.56,17.78 6.99,17.78 6.99,13.97 8.26,12.7

### Text on the board
tNames: A | D | Q | A | Q | D | ACC | PC | T0 | T1 | VCC | VCC | VCC | ALU_PC | ALU_A | O_ACC | O_PC | Q_OUT | L_ACC | I_A | I_PC | L_PC | GND | GND | L_T0 | ALU_Q0 | ALU_Q1 | L_T1 | OA_T0 | OD_T0 | OQ_T0 | OA_T1 | OQ_T1 | OD_T1 | GND | GND | GND | A | D_OUT